# Altium project BEE-DAL_EXP_V1.0.PrjPcb (part 1 of 2)
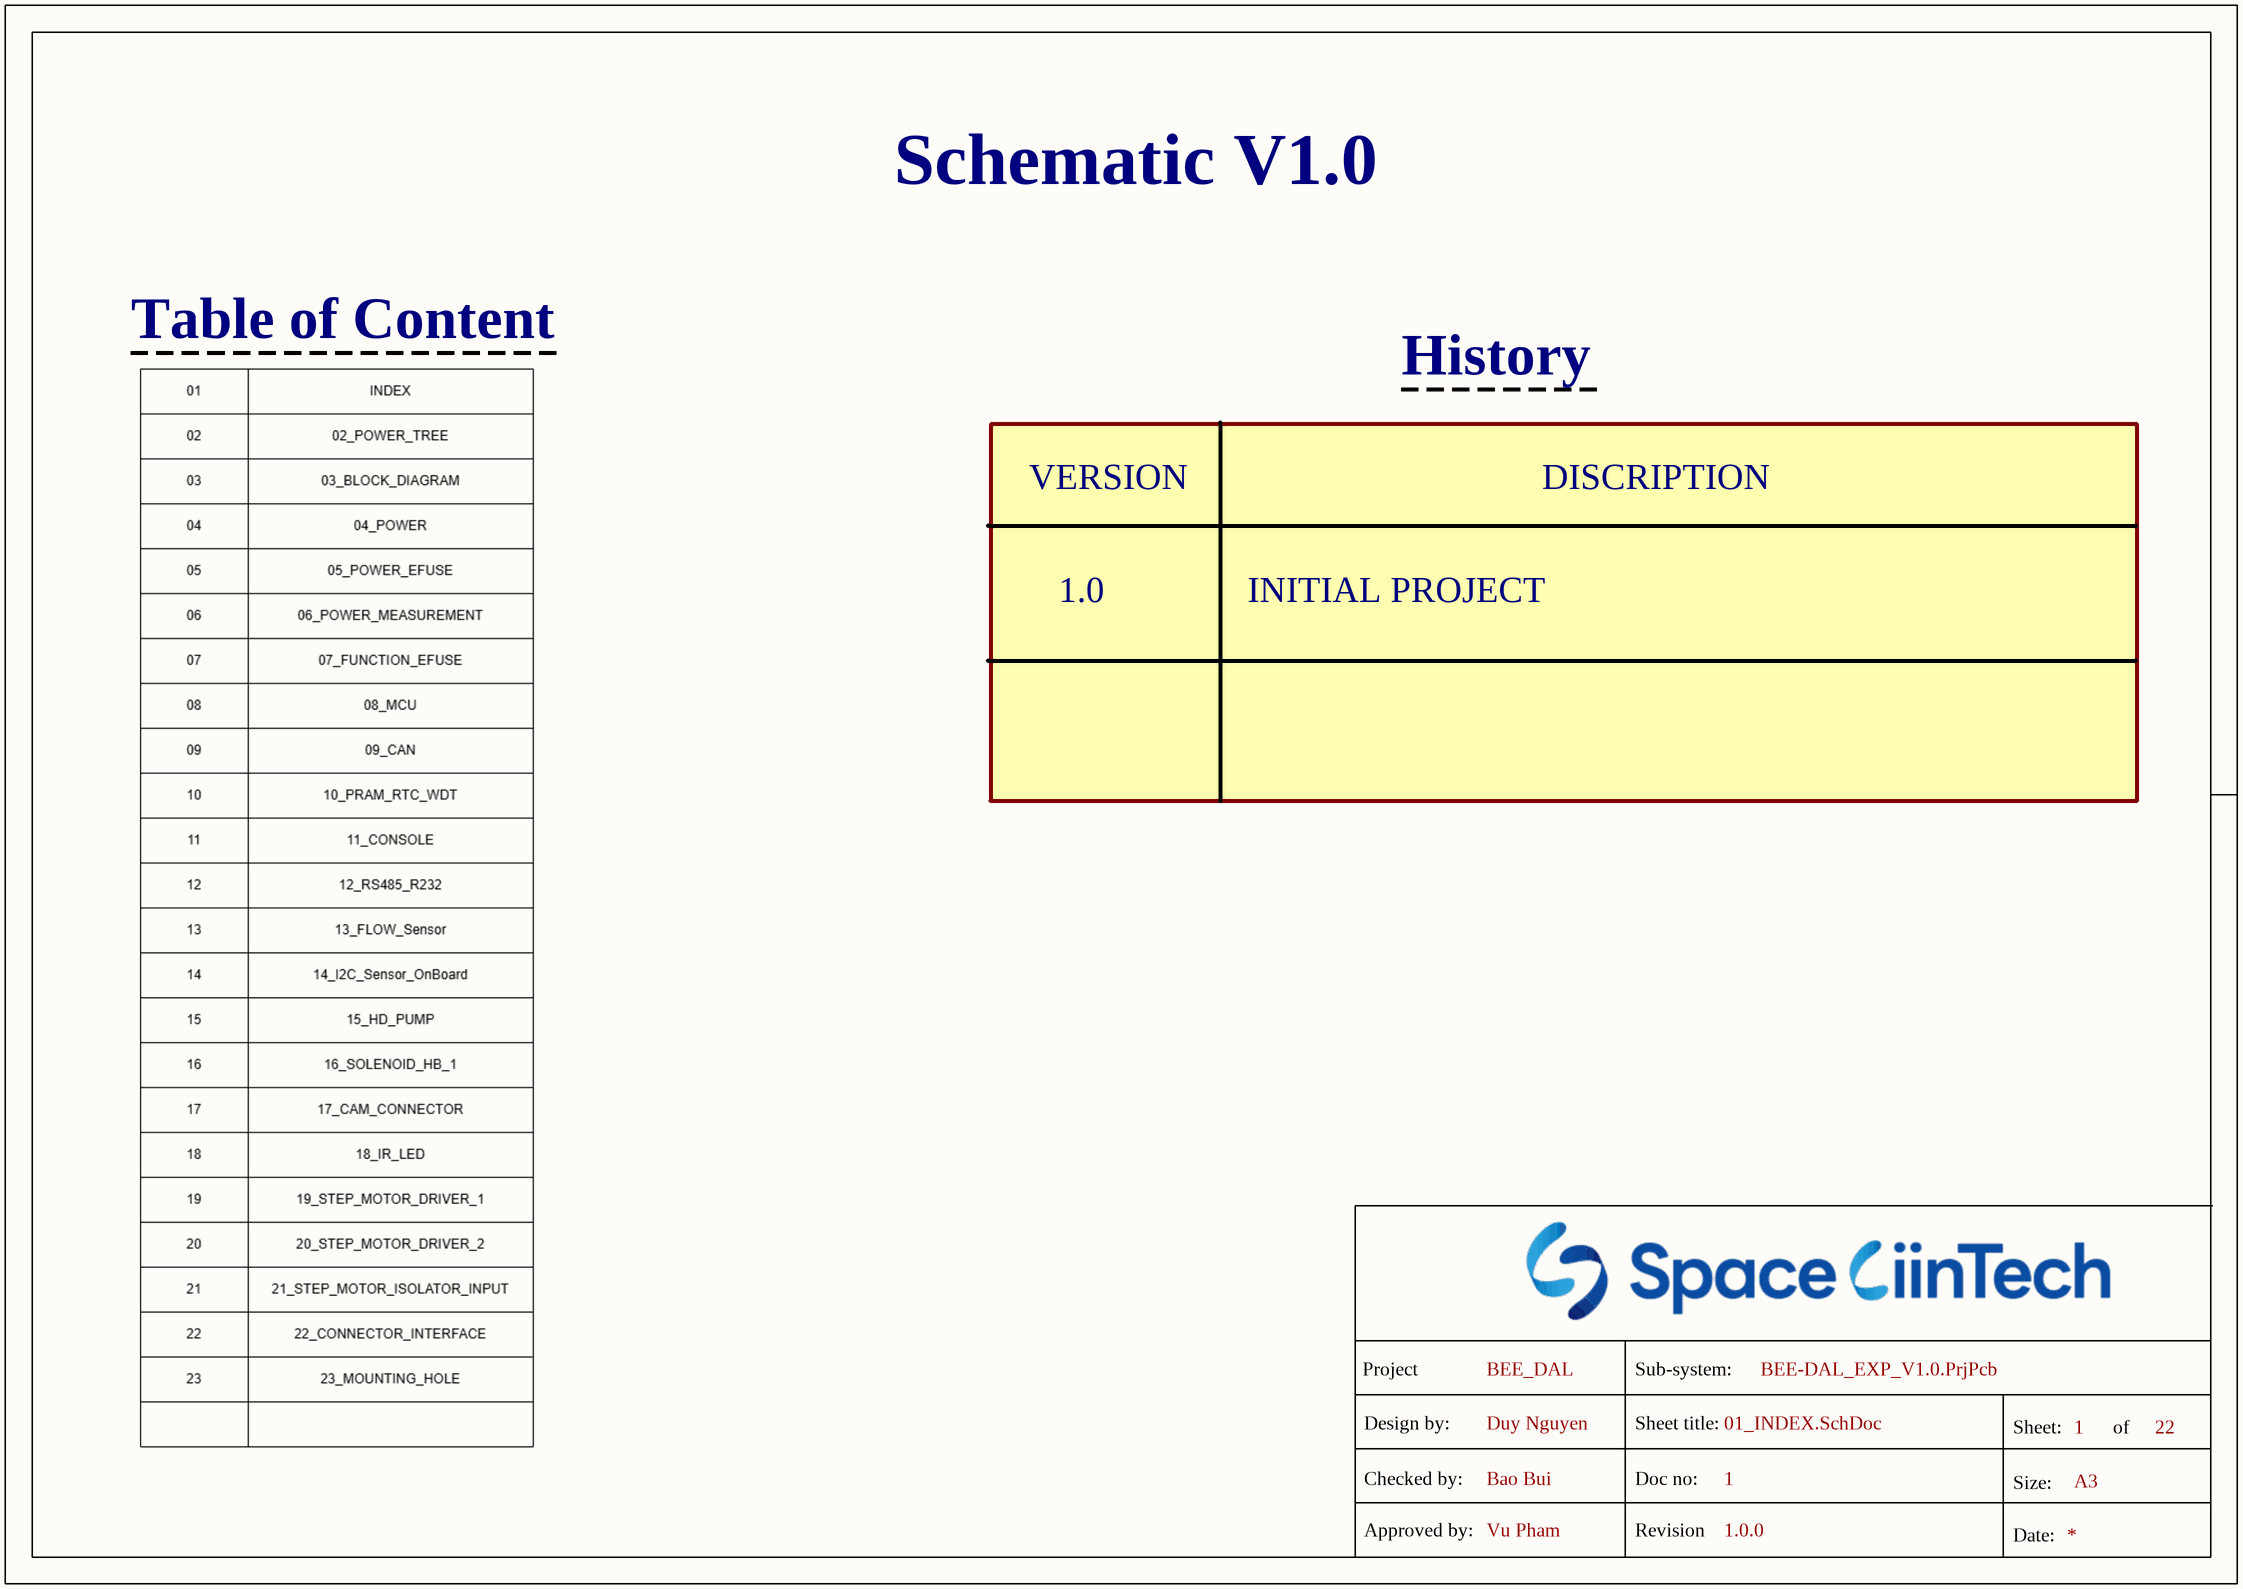
[diagram p0: 01_INDEX.SchDoc]
Approvedby: Vu Pham; Checkedby: Bao Bui; Drawnby: Duy Nguyen; MasterProject: BEE_DAL; Revision: 1.0.0; Size: A3
27 sheets, 708 parts. Net scope: flat (ports and power ports of the same name join across sheets).
Board file: BEE-DAL_EXP_V1.0.PcbDoc
Sheets:
  01_INDEX.SchDoc
  02_POWER_TREE.SchDoc
  03_BLOCK_DIAGRAM.SchDoc
  04_POWER.SchDoc
  05_POWER_EFUSE.SchDoc
  06_POWER_MEASUREMENT.SchDoc
  07_FUNCTION_EFUSE.SchDoc
  08_MCU.SchDoc
  09_CAN.SchDoc
  10_PRAM_RTC_WDT.SchDoc
  11_CONSOLE.SchDoc
  12_RS485_R232.SchDoc
  13_FLOW_Sensor.SchDoc
  14_I2C_Sensor_OnBoard.SchDoc
  15_HD_PUMP.SchDoc
  16_SOLENOID_HB_1.SchDoc
  17_CAM_CONNECTOR.SchDoc
  18_IR_LED.SchDoc
  HEATER.SchDoc
  NTC.SchDoc
  LIMIT_SENSORS.SchDoc
  HALF_BRIDGE_DRIVER.SchDoc
  19_STEP_MOTOR_DRIVER_1.SchDoc
  20_STEP_MOTOR_DRIVER_2.SchDoc
  21_STEP_MOTOR_ISOLATOR_INPUT.SchDoc
  22_CONNECTOR_INTERFACE.SchDoc
  23_MOUNTING_HOLE.SchDoc

## Sheet 01_INDEX.SchDoc
size 420 x 297 mm; SheetNumber: 1; SheetTotal: 22

### Notes on the sheet
- Schematic V1.0
- Table of Content
- History
- VERSION
- DISCRIPTION
- 1.0
- INITIAL PROJECT
- Project
- Sub-system:
- Design by:
- Sheet title:
- Sheet:
- of
- Checked by:
- Approved by:
- Doc no:
- Revision
- Size:
- Date:

## Sheet 02_POWER_TREE.SchDoc
size 420 x 297 mm; DrawnBy: Duy Nguyen; SheetNumber: 2; SheetTotal: 22

### Notes on the sheet
- Project
- Sub-system:
- Design by:
- Sheet title:
- Sheet:
- of
- Checked by:
- Approved by:
- Doc no:
- Revision
- Size:
- Date:
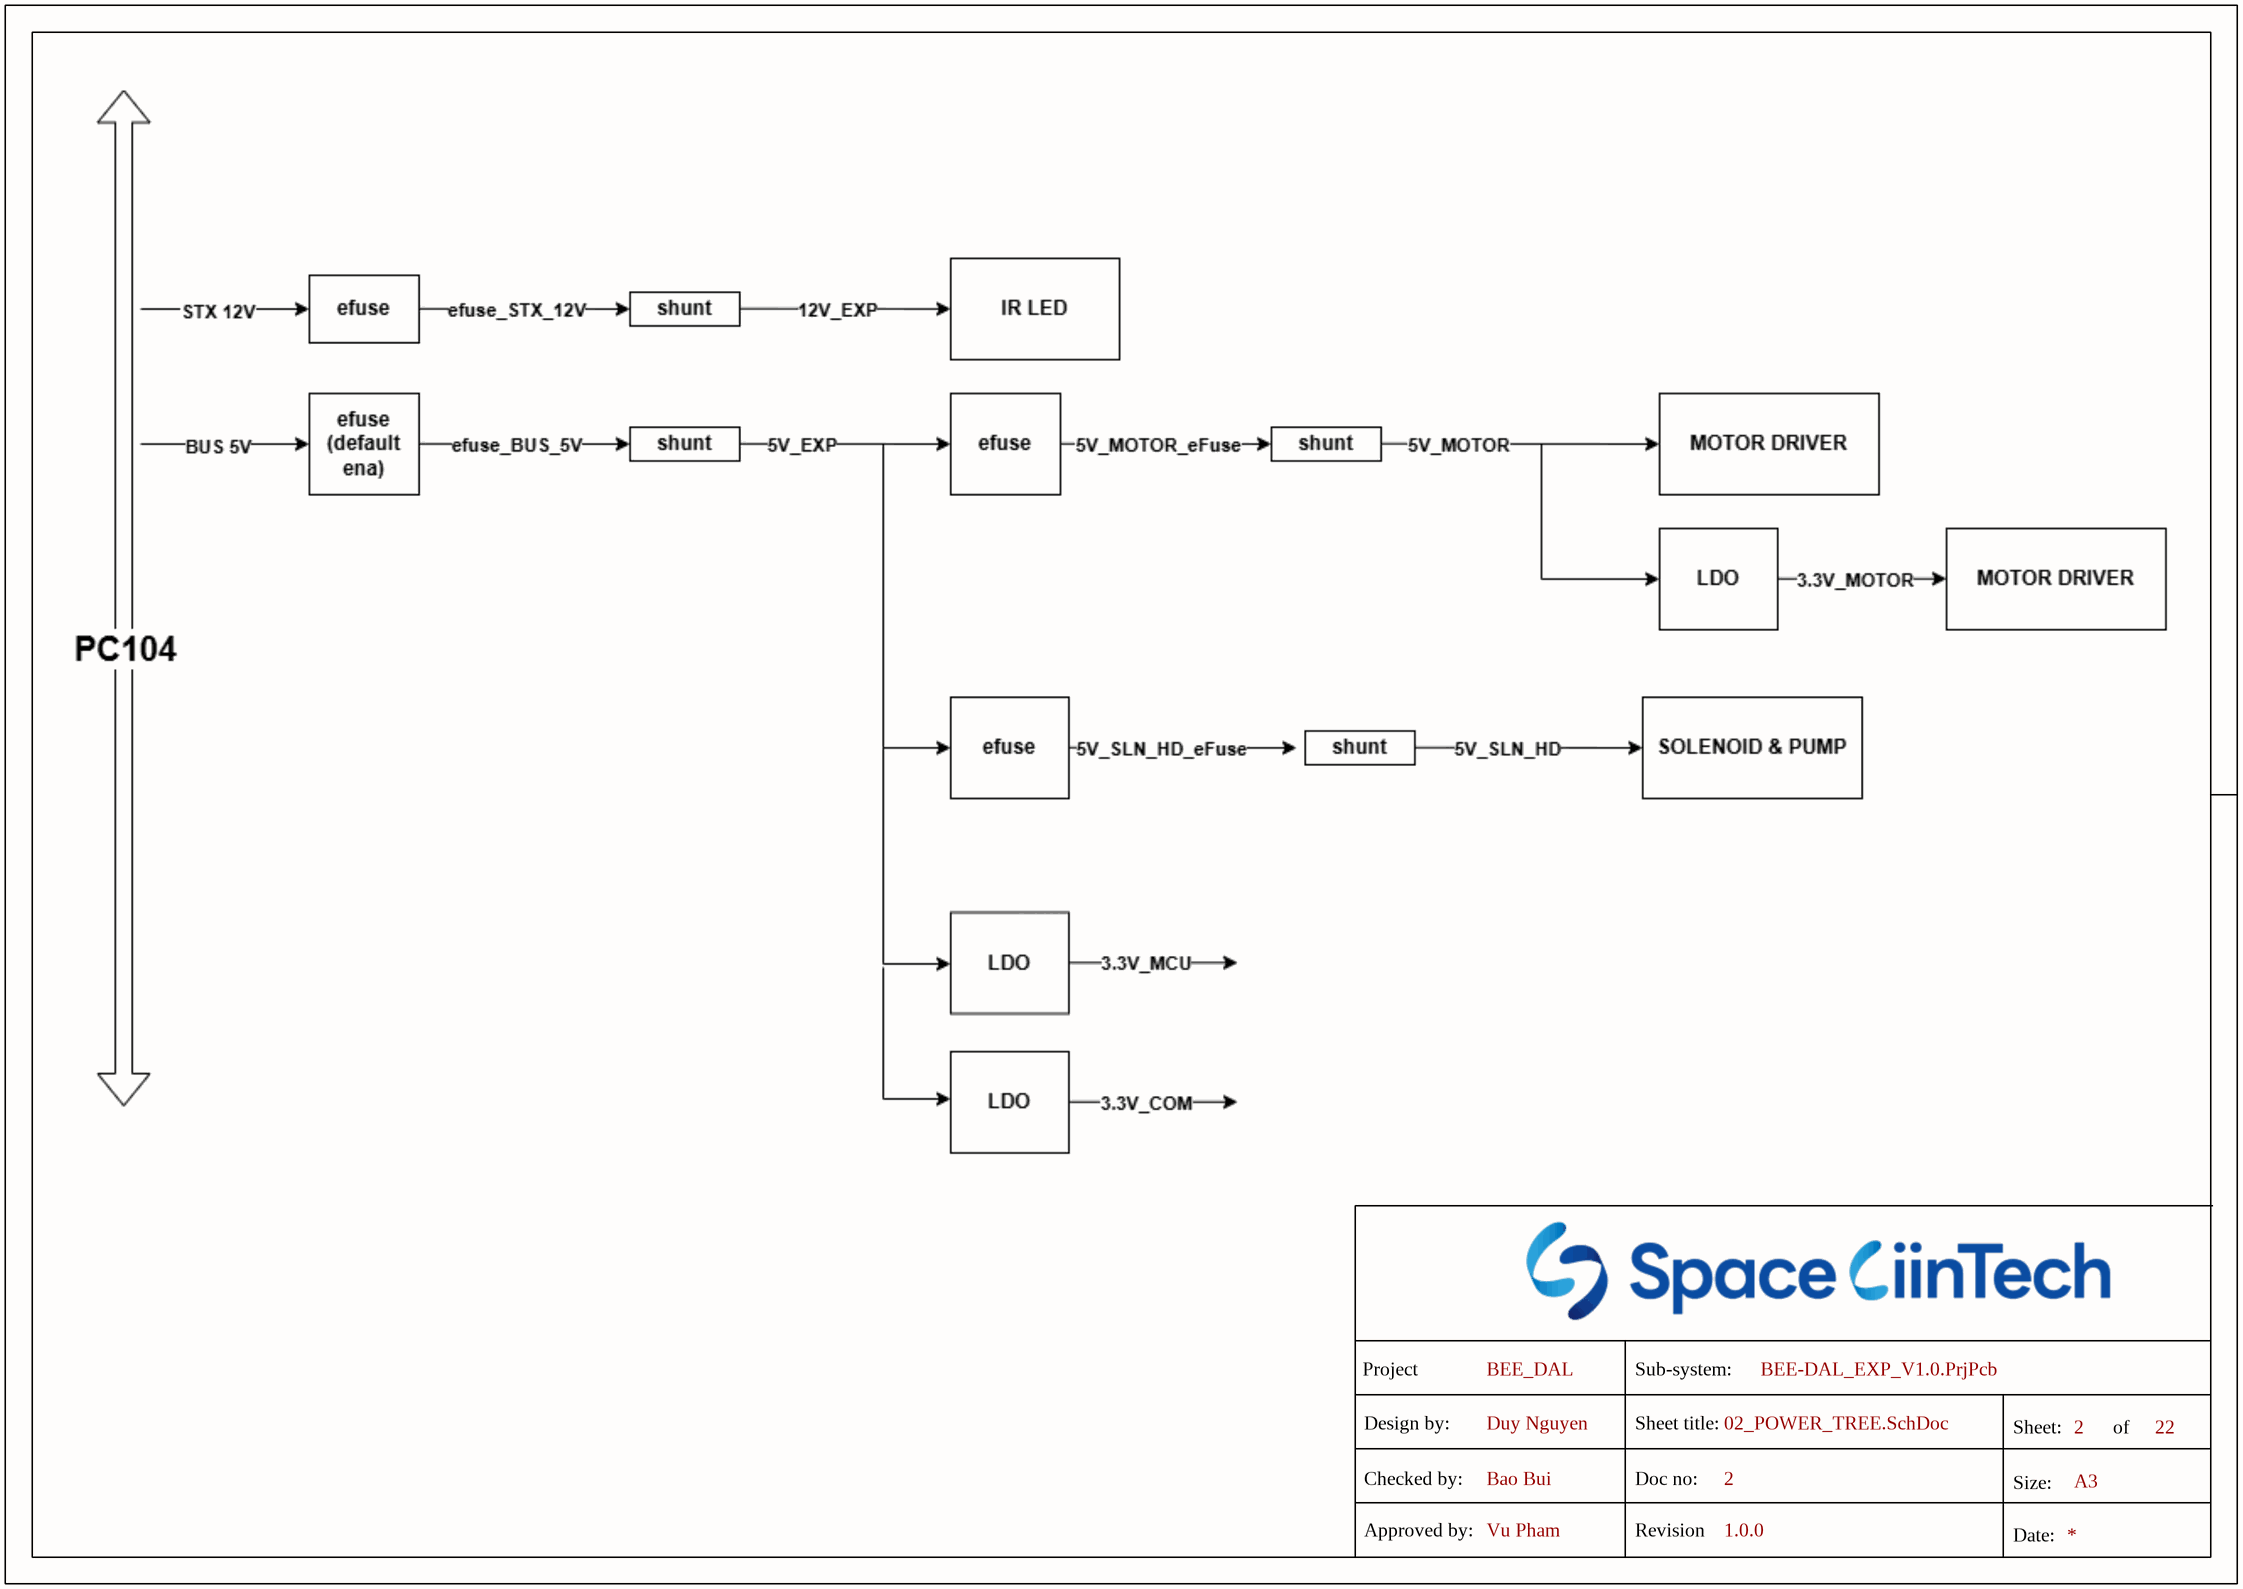
[diagram p1: 02_POWER_TREE.SchDoc]

## Sheet 03_BLOCK_DIAGRAM.SchDoc
size 420 x 297 mm; SheetNumber: 3; SheetTotal: 22

### Notes on the sheet
- Project
- Sub-system:
- Design by:
- Sheet title:
- Sheet:
- of
- Checked by:
- Approved by:
- Doc no:
- Revision
- Size:
- Date:
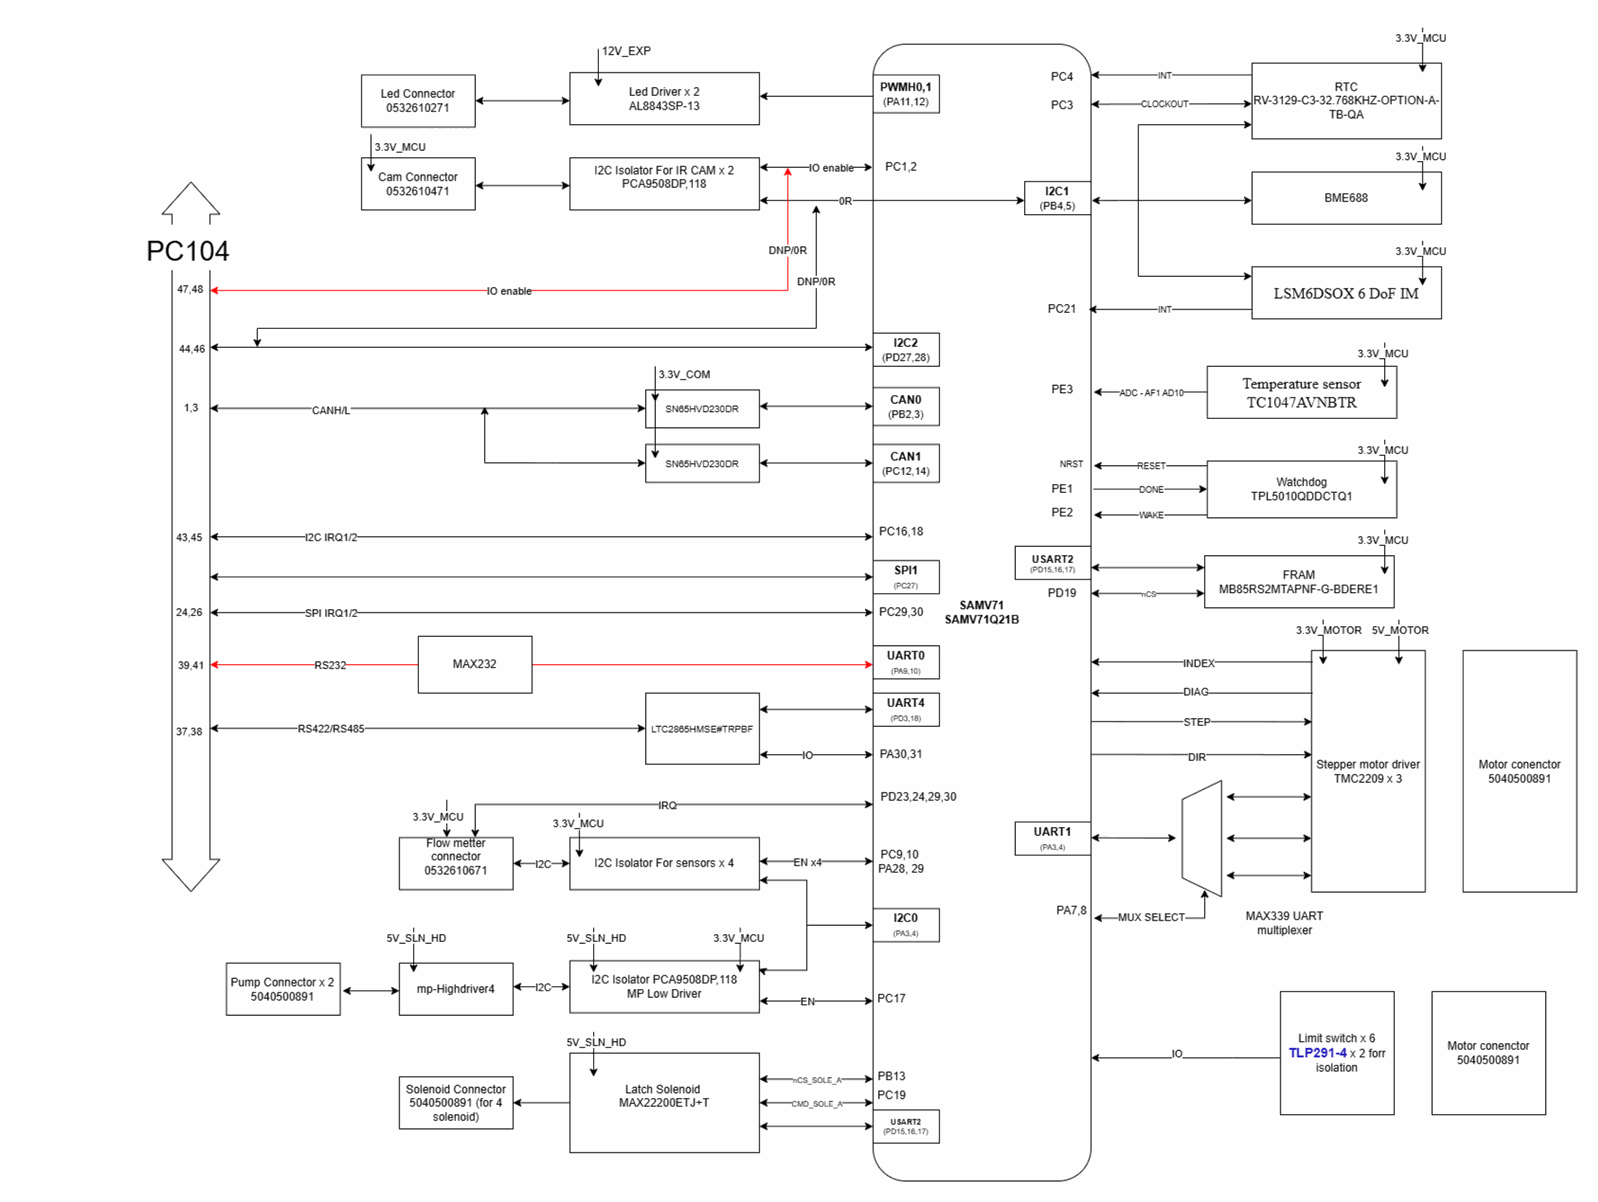
[diagram p2: 03_BLOCK_DIAGRAM.SchDoc]

## Sheet 04_POWER.SchDoc
size 420 x 297 mm; SheetNumber: 4; SheetTotal: 27
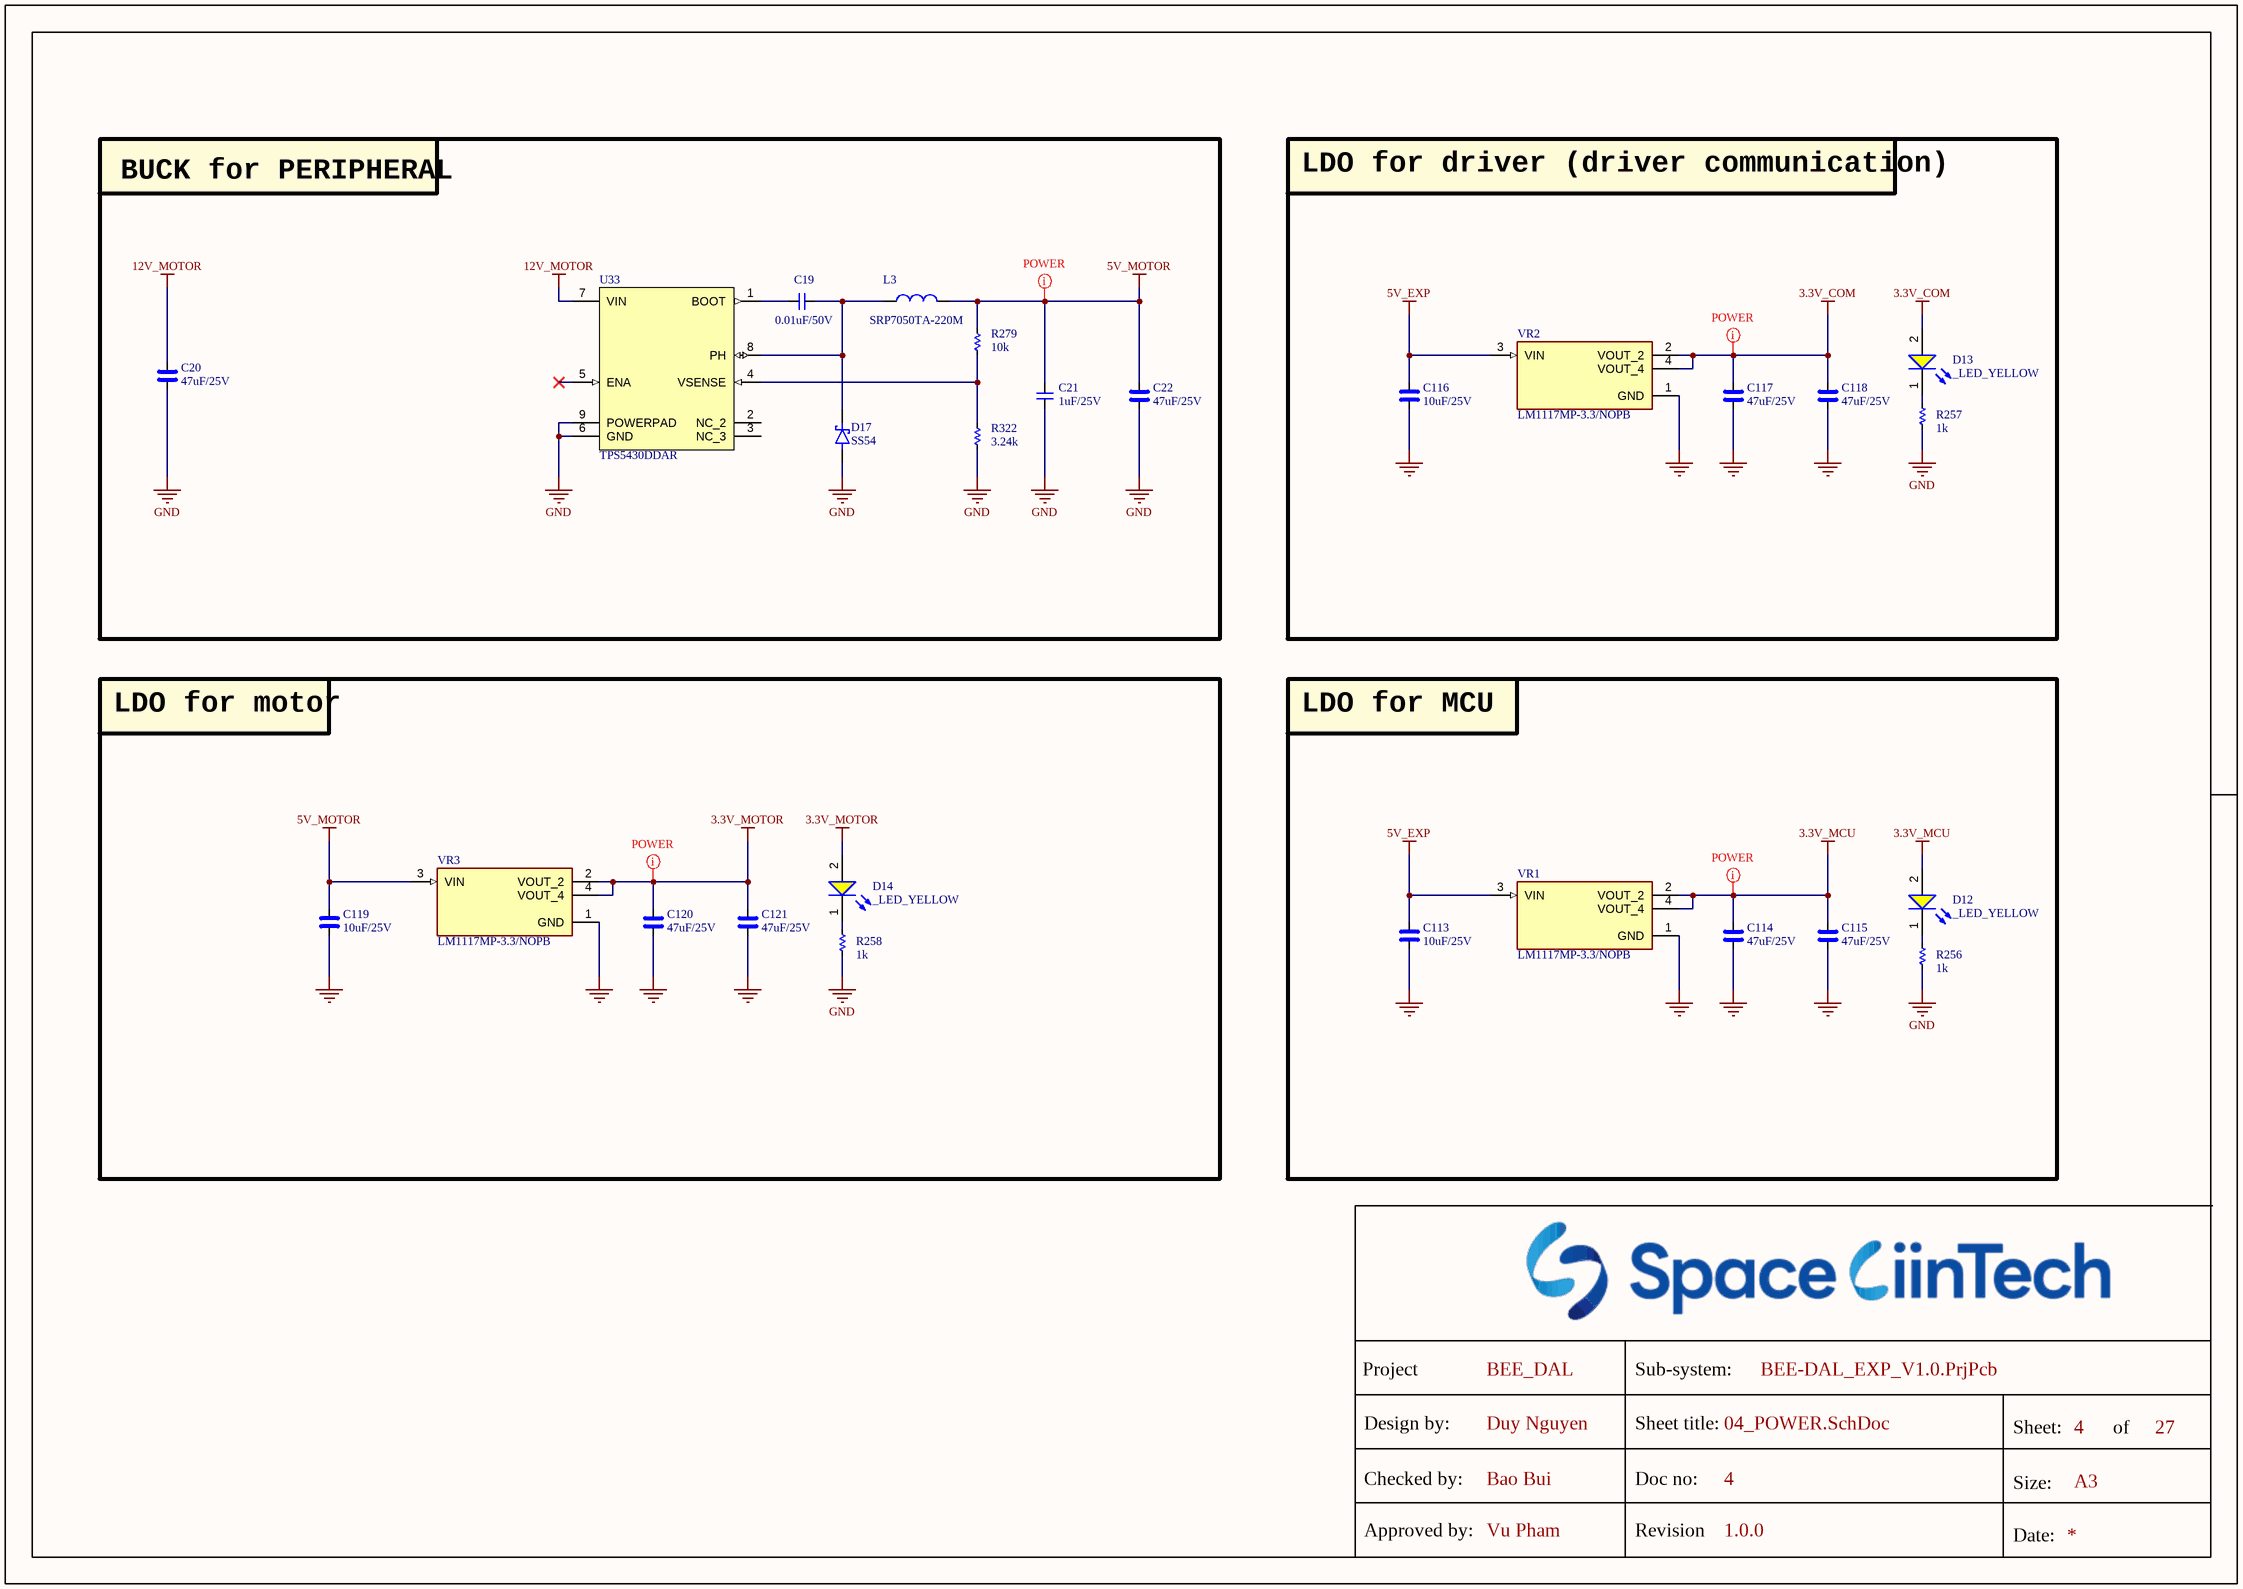
[diagram p3: 04_POWER.SchDoc]

### Parts
(Parts that share a designator on the sheet are numbered #1, #2 ... from top to bottom, then left to right.)
C19#1  0.01uF/50V  [CAP_C_1608X80]
C20#1  47uF/25V  [CAP_C_3225X80]
C21#1  1uF/25V  [CAP_C_1005X60]
C22#1  47uF/25V  [CAP_C_3225X80]
C113  10uF/25V  [CAP_C_2012X110]
C114  47uF/25V  [CAP_C_3225X80]
C115  47uF/25V  [CAP_C_3225X80]
C116  10uF/25V  [CAP_C_2012X110]
C117  47uF/25V  [CAP_C_3225X80]
C118  47uF/25V  [CAP_C_3225X80]
C119  10uF/25V  [CAP_C_2012X110]
C120  47uF/25V  [CAP_C_3225X80]
C121  47uF/25V  [CAP_C_3225X80]
D12  _LED_YELLOW  [LED_0603]
D13  _LED_YELLOW  [LED_0603]
D14  _LED_YELLOW  [LED_0603]
D17  SS54  [DO-214AC_SMA]
L3  SRP7050TA-220M  [PSM6050]
R256  1k  [RES_C_1005X40]
R257  1k  [RES_C_1005X40]
R258  1k  [RES_C_1005X40]
R279  10k  [RES_C_1005X40]
R322  3.24k  [RES_C_1005X40]
U33  TPS5430DDAR  [TPS54531DDAR]
VR1  LM1117MP-3.3/NOPB  [VREG_LM1117MP-3.3/NOPB]
VR2  LM1117MP-3.3/NOPB  [VREG_LM1117MP-3.3/NOPB]
VR3  LM1117MP-3.3/NOPB  [VREG_LM1117MP-3.3/NOPB]

### Blocks framed on the sheet
BUCK for PERIPHERAL: C19#1 C20#1 C21#1 C22#1 D17 L3 R279 R322 U33
LDO for driver (driver communication): C116-C118 D13 R257 VR2
LDO for motor: C119-C121 D14 R258 VR3
LDO for MCU: C113-C115 D12 R256 VR1

### Nets
3.3V_COM: C117.2 C118.2 D13.2(A) VR2.2(VOUT_2) VR2.4(VOUT_4)
3.3V_MCU: C114.2 C115.2 D12.2(A) VR1.2(VOUT_2) VR1.4(VOUT_4)
3.3V_MOTOR: C120.2 C121.2 D14.2(A) VR3.2(VOUT_2) VR3.4(VOUT_4)
5V_EXP: C113.1 C116.1 VR1.3(VIN) VR2.3(VIN)
5V_MOTOR: C21#1.2 C22#1.2 C119.1 L3.2 R279.2 VR3.3(VIN)
12V_MOTOR: C20#1.2 U33.7(VIN)
GND: C20#1.1 C21#1.1 C22#1.1 C113.2 C114.1 C115.1 C116.2 C117.1 C118.1 C119.2 C120.1 C121.1 D17.2(A) R256.1 R257.1 R258.1 R322.1 U33.6(GND) U33.9(POWERPAD) VR1.1(GND) VR2.1(GND) VR3.1(GND)
NetC19#1_1: C19#1.1 D17.1(K) L3.1 U33.8(PH)
NetC19#1_2: C19#1.2 U33.1(BOOT)
NetD12_1: D12.1(K) R256.2
NetD13_1: D13.1(K) R257.2
NetD14_1: D14.1(K) R258.2
NetR279_1: R279.1 R322.2 U33.4(VSENSE)

Not connected (* = marked no-connect by the designer): U33 2(NC_2) 3(NC_3) 5(ENA)*

### Layout directives
net class POWER: 3.3V_COM, 3.3V_MCU, 3.3V_MOTOR, 5V_MOTOR

### Notes on the sheet
- Project
- Sub-system:
- Design by:
- Sheet title:
- Sheet:
- of
- Checked by:
- Approved by:
- Doc no:
- Revision
- Size:
- Date:

### Library data of the parts
C19#1 C21#1 = _CAP_C_2: CAP
C20#1 C22#1 C113-C121 = _CAP_C_High_2: CAP High Value
D17 = DIODE SCHOTTKY
L3 = SRP7050TA-220M: FIXED IND 22UH 2.5A 170 MOHM SMD
R256-R258 R279 R322 = _RES_B_2: RES
U33 = TPS5430DDAR: IC REG BUCK ADJ 3A 8SOPWR
VR1-VR3 = LM1117MP-3.3/NOPB: 800-mA 15-V linear voltage regulator; MF: Texas Instruments; SnapEDA_Link: https://www.snapeda.com/parts/LM1117MP-3.3/NOPB/Texas+Instruments/view-part/?ref=snap; Package: SOT-223-4 Texas Instruments; Value: *; MP: LM1117MP-3.3/NOPB; Check_prices: https://www.snapeda.com/parts/LM1117MP-3.3/NOPB/Texas+Instruments/view-part/?ref=eda

## Sheet 05_POWER_EFUSE.SchDoc
size 420 x 297 mm; SheetNumber: 5; SheetTotal: 27
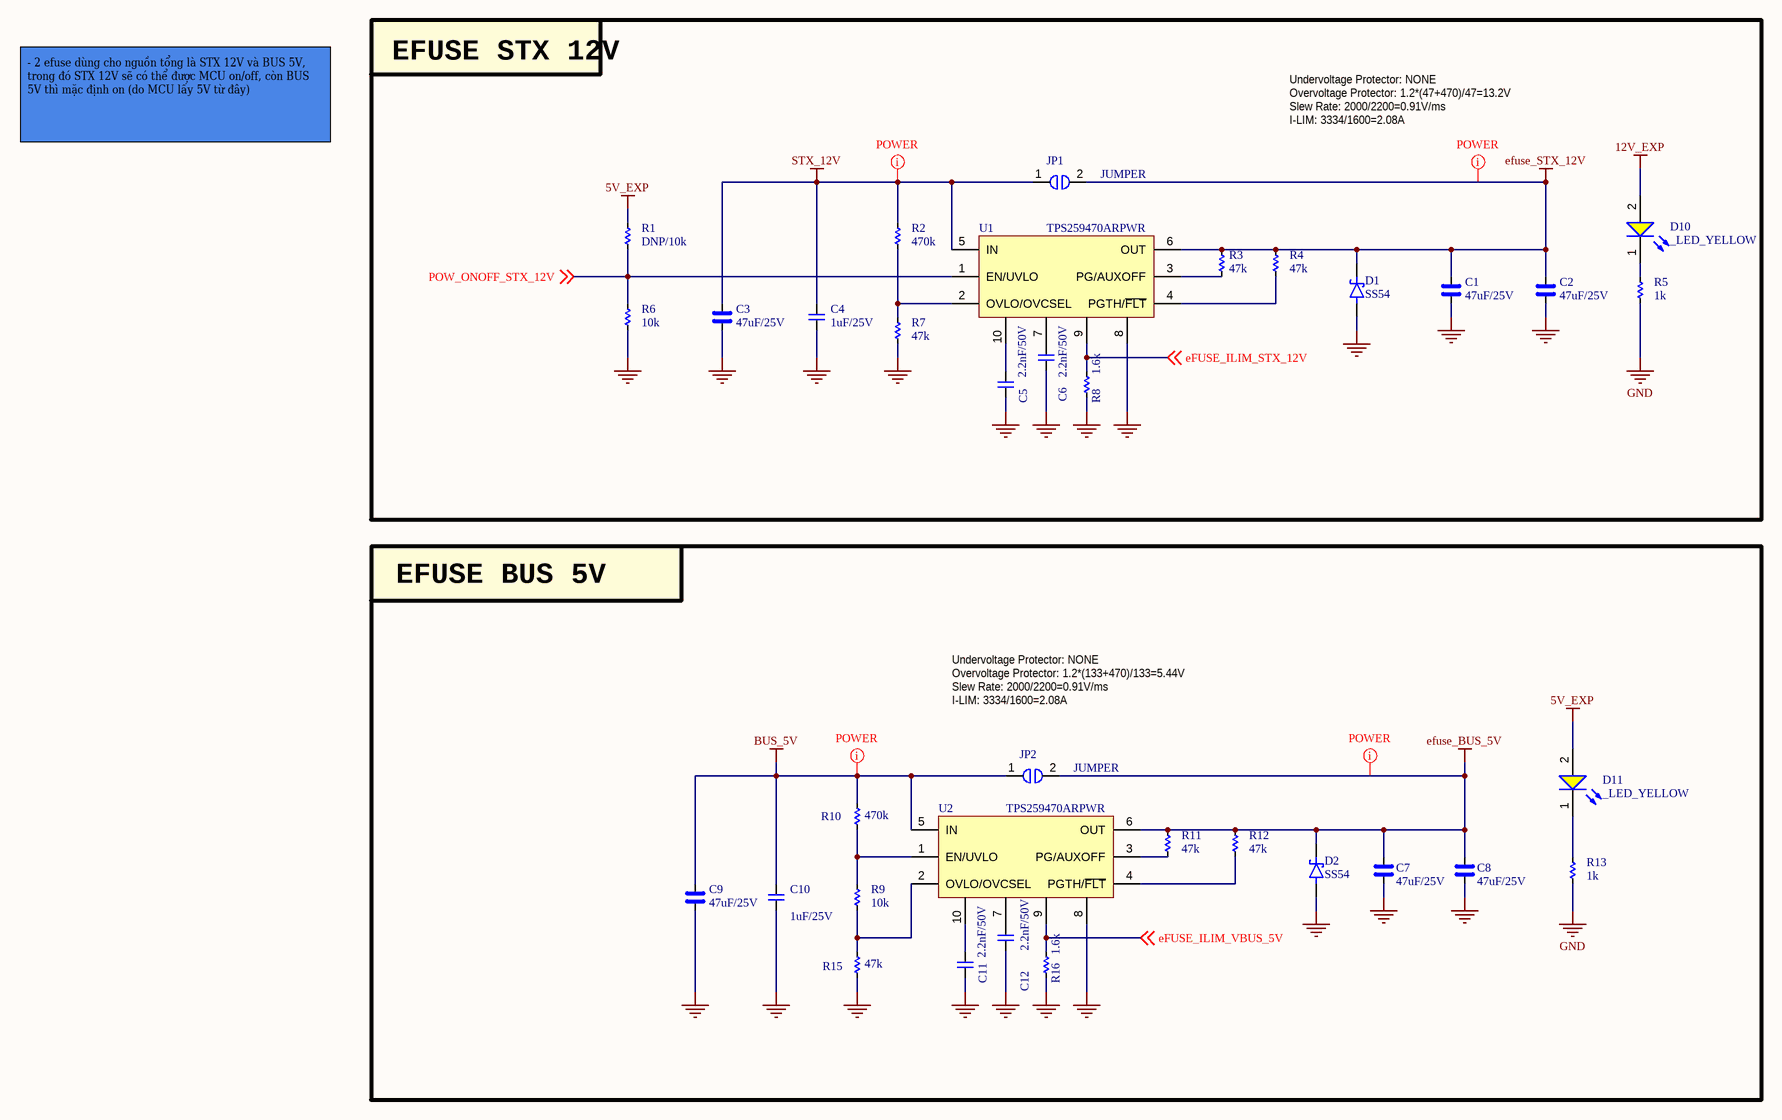
[diagram p4: 05_POWER_EFUSE.SchDoc]

### Parts
C1  47uF/25V  [CAP_C_3225X80]
C2  47uF/25V  [CAP_C_3225X80]
C3  47uF/25V  [CAP_C_3225X80]
C4  1uF/25V  [CAP_C_1005X60]
C5  2.2nF/50V  [CAP_C_1005X60]
C6  2.2nF/50V  [CAP_C_1005X60]
C7  47uF/25V  [CAP_C_3225X80]
C8  47uF/25V  [CAP_C_3225X80]
C9  47uF/25V  [CAP_C_3225X80]
C10  1uF/25V  [CAP_C_1005X60]
C11  2.2nF/50V  [CAP_C_1005X60]
C12  2.2nF/50V  [CAP_C_1005X60]
D1  SS54  [DO-214AC_SMA]
D2  SS54  [DO-214AC_SMA]
D10  _LED_YELLOW  [LED_0603]
D11  _LED_YELLOW  [LED_0603]
JP1  JUMPER  [JUMPER_1608]
JP2  JUMPER  [JUMPER_1608]
R1  DNP/10k  [RES_C_1005X40]
R2  470k  [RES_C_1005X40]
R3  47k  [RES_C_1005X40]
R4  47k  [RES_C_1005X40]
R5  1k  [RES_C_1005X40]
R6  10k  [RES_C_1005X40]
R7  47k  [RES_C_1005X40]
R8  1.6k  [RES_C_1005X40]
R9  10k  [RES_C_1005X40]
R10  470k  [RES_C_1005X40]
R11  47k  [RES_C_1005X40]
R12  47k  [RES_C_1005X40]
R13  1k  [RES_C_1005X40]
R15  47k  [RES_C_1005X40]
R16  1.6k  [RES_C_1005X40]
U1  TPS259470ARPWR  [VQFN-HR-10]
U2  TPS259470ARPWR  [VQFN-HR-10]

### Blocks framed on the sheet
EFUSE STX 12V: C1-C6 D1 D10 JP1 R1-R8 U1
EFUSE BUS 5V: C7-C12 D2 D11 JP2 R9-R13 R15 R16 U2

### Nets
5V_EXP: D11.2(A) R1.1
12V_EXP: D10.2(A)
BUS_5V: C9.2 C10.2 JP2.1 R10.2 U2.5(IN)
efuse_BUS_5V: C7.2 C8.2 D2.1(K) JP2.2 R11.2 R12.2 U2.6(OUT)
efuse_STX_12V: C1.2 C2.2 D1.1(K) JP1.2 R3.2 R4.2 U1.6(OUT)
GND: C1.1 C2.1 C3.1 C4.1 C5.1 C6.1 C7.1 C8.1 C9.1 C10.1 C11.1 C12.1 D1.2(A) D2.2(A) R5.1 R6.2 R7.1 R8.1 R13.1 R15.1 R16.1 U1.8 U2.8
STX_12V: C3.2 C4.2 JP1.1 R2.2 U1.5(IN)
eFUSE_ILIM_STX_12V: R8.2 U1.9 ; off-sheet eFUSE_ILIM_STX_12V
eFUSE_ILIM_VBUS_5V: R16.2 U2.9 ; off-sheet eFUSE_ILIM_VBUS_5V
POW_ONOFF_STX_12V: R1.2 R6.1 U1.1(EN/UVLO) ; off-sheet POW_ONOFF_STX_12V
NetC5_2: C5.2 U1.10
NetC6_2: C6.2 U1.7
NetC11_2: C11.2 U2.10
NetC12_2: C12.2 U2.7
NetD10_1: D10.1(K) R5.2
NetD11_1: D11.1(K) R13.2
NetR2_1: R2.1 R7.2 U1.2(OVLO/OVCSEL)
NetR3_1: R3.1 U1.3(PG/AUXOFF)
NetR4_1: R4.1 U1.4(PGTH/~{FLT})
NetR9_1: R9.1 R15.2 U2.2(OVLO/OVCSEL)
NetR9_2: R9.2 R10.1 U2.1(EN/UVLO)
NetR11_1: R11.1 U2.3(PG/AUXOFF)
NetR12_1: R12.1 U2.4(PGTH/~{FLT})

### Layout directives
net class POWER: BUS_5V, efuse_BUS_5V, efuse_STX_12V, STX_12V

### Notes on the sheet
- - 2 efuse dùng cho nguồn tổng là STX 12V và BUS 5V, trong đó STX 12V sẽ có thể được MCU on/off, còn BUS 5V thì mặc định on (do MCU lấy 5V từ đây)
- Undervoltage Protector: NONE
- Overvoltage Protector: 1.2*(47+470)/47=13.2V
- Slew Rate: 2000/2200=0.91V/ms
- I-LIM: 3334/1600=2.08A
- Overvoltage Protector: 1.2*(133+470)/133=5.44V
- Project
- Sub-system:
- Design by:
- Sheet title:
- Sheet:
- of
- Checked by:
- Approved by:
- Doc no:
- Revision
- Size:
- Date:

### Library data of the parts
C1-C3 C7-C9 = _CAP_C_High_2: CAP High Value
C4-C6 C10-C12 = _CAP_C_2: CAP
D1 D2 = DIODE SCHOTTKY
JP1 JP2 = JUMPER_1_1
R1-R13 R15 R16 = _RES_B_2: RES

## Sheet 06_POWER_MEASUREMENT.SchDoc
size 420 x 297 mm; SheetNumber: 6; SheetTotal: 27
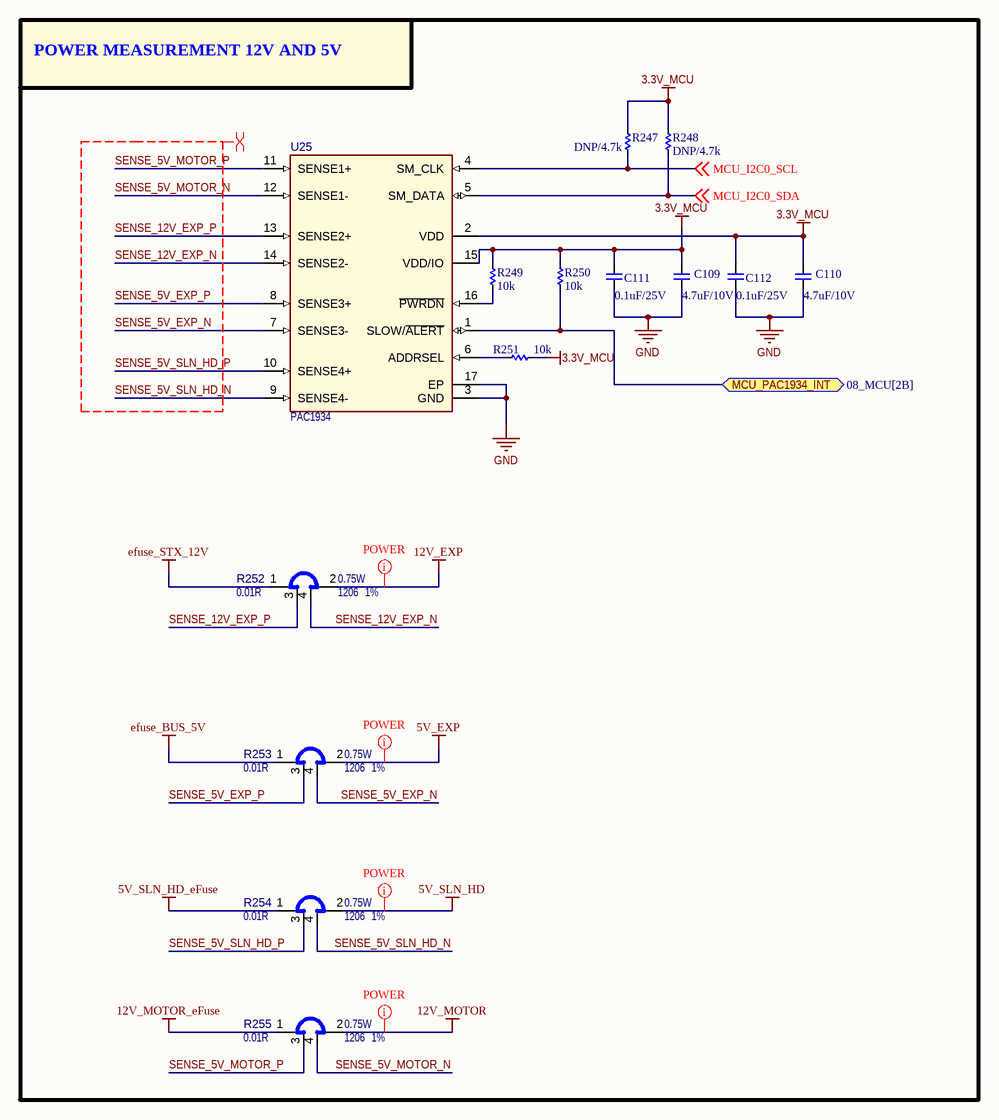
[diagram p5: 06_POWER_MEASUREMENT.SchDoc]

### Parts
C109  4.7uF/10V  [CAP_C_1005X60]
C110  4.7uF/10V  [CAP_C_1005X60]
C111  0.1uF/25V  [CAP_C_1005X60]
C112  0.1uF/25V  [CAP_C_1005X60]
R247  DNP/4.7k  [RES_C_1005X40]
R248  DNP/4.7k  [RES_C_1005X40]
R249  10k  [RES_C_1005X40]
R250  10k  [RES_C_1005X40]
R251  10k  [RES_C_1005X40]
R252  value 0.01R  Package: 1206  Tolerance: 1%  Power: 0.75W  [RES_C_1206_SHUNT]  (hidden comment: KRL1632E-M-R010-F-T5)
R253  value 0.01R  Package: 1206  Tolerance: 1%  Power: 0.75W  [RES_C_1206_SHUNT]  (hidden comment: KRL1632E-M-R010-F-T5)
R254  value 0.01R  Package: 1206  Tolerance: 1%  Power: 0.75W  [RES_C_1206_SHUNT]  (hidden comment: KRL1632E-M-R010-F-T5)
R255  value 0.01R  Package: 1206  Tolerance: 1%  Power: 0.75W  [RES_C_1206_SHUNT]  (hidden comment: KRL1632E-M-R010-F-T5)
U25  value PAC1934  [UQFN-16_4X4_EP2.6X2.6]  (hidden comment: PAC1934 UQFN-16)

### Blocks framed on the sheet
POWER MEASUREMENT 12V AND 5V: C109-C112 R247-R255 U25

### Ports
MCU_PAC1934_INT (bidir, see 08_MCU[2B])

### Nets
3.3V_MCU: C109.1 C110.1 C111.1 C112.1 R247.1 R248.1 R249.1 R250.1 R251.2 U25.2(VDD) U25.15(VDD/IO)
5V_EXP: R253.2
5V_SLN_HD: R254.2
5V_SLN_HD_eFuse: R254.1
12V_EXP: R252.2
12V_MOTOR: R255.2
12V_MOTOR_eFuse: R255.1
efuse_BUS_5V: R253.1
efuse_STX_12V: R252.1
GND: C109.2 C110.2 C111.2 C112.2 U25.3(GND) U25.17(EP)
MCU_I2C0_SCL: R247.2 U25.4(SM_CLK) ; off-sheet MCU_I2C0_SCL
MCU_I2C0_SDA: R248.2 U25.5(SM_DATA) ; off-sheet MCU_I2C0_SDA
SENSE_5V_EXP_N: R253.4 U25.7(SENSE3-)
SENSE_5V_EXP_P: R253.3 U25.8(SENSE3+)
SENSE_5V_MOTOR_N: R255.4 U25.12(SENSE1-)
SENSE_5V_MOTOR_P: R255.3 U25.11(SENSE1+)
SENSE_5V_SLN_HD_N: R254.4 U25.9(SENSE4-)
SENSE_5V_SLN_HD_P: R254.3 U25.10(SENSE4+)
SENSE_12V_EXP_N: R252.4 U25.14(SENSE2-)
SENSE_12V_EXP_P: R252.3 U25.13(SENSE2+)
NetR61_2: R250.2 U25.1(SLOW/~{ALERT}) ; port MCU_PAC1934_INT
NetR249_2: R249.2 U25.16(~{PWRDN})
NetR251_1: R251.1 U25.6(ADDRSEL)

### Layout directives
differential pair: SENSE_5V_EXP_N, SENSE_5V_EXP_P, SENSE_5V_MOTOR_N, SENSE_5V_MOTOR_P, SENSE_5V_SLN_HD_N, SENSE_5V_SLN_HD_P, SENSE_12V_EXP_N, SENSE_12V_EXP_P
net class POWER: 5V_EXP, 5V_SLN_HD, 12V_EXP, 12V_MOTOR

### Notes on the sheet
- Project
- Sub-system:
- Design by:
- Sheet title:
- Sheet:
- of
- Checked by:
- Approved by:
- Doc no:
- Revision
- Size:
- Date:

### Library data of the parts
C109-C112 = _CAP_C_2: CAP
R247-R251 = _RES_B_2: RES
R252-R255 = RSMT1316: Shunt; Manufacturer 1: SUSUMU; Description_: RES SHUNT MF 0.01R 1% 0.75W SMD 1206; Dev Tools Status: Design; Temperature Coeffcient: 50ppm/C; Current: 8A; Owner: Ciprian Abramov; Populated: YES; MCHP-ID: RSMT1316; Revision: 1; Symbol: Shunt 4 Pin; Status: MCL Design; ComponentLink1URL: https://chn-vm-apps.microchip.com/mchprepo/parts/Datasheets/n_catalog_partition09_en.pdf; ComponentLink1Description: SVN Datasheet; ComponentLink2URL: C:\ALTIUM_WORK\00001_MCHP-CDB\Datasheets\n_catalog_partition09_en.pdf; ComponentLink2Description: Local Datasheet; ComponentLink3URL: C:\ALTIUM_WORK\00001_MCHP-CDB\Library\LibraryRefs\Shunt 4 Pin.SchLib; ComponentLink3Description: Open Symbol; ComponentLink4URL: C:\ALTIUM_WORK\00001_MCHP-CDB\Library\Footprints\RES_C_1206_SHUNT.PcbLib; ComponentLink4Description: Open Footprint; ComponentLink5Description: Open Footprint 2; ComponentLink6Description: Open Footprint 3; ComponentLink7Description: Open Footprint 4; Operating Temperature: -55C to +155C; Category: Resistor; Type: RES SMD; Composition: MF; Manufacturer Part Number 1: KRL1632E-M-R010-F-T5; Supplier 1: Digi-Key; Supplier Part Number 1: 408-1570-1-ND; Quantity Override: 1
U25 = MIC8883: Manufacturer 1: Microchip Technology; Manufacturer Part Number 1: PAC1934T-I/JQ; Description_: MCHP ANALOG POWER CURRENT SENSE MONITOR PAC1934T-I/JQ UQFN-16; Dev Tools Status: Design; Owner: Ciprian Abramov; Populated: YES; MCHP-ID: MIC8883; Symbol: PAC1934 UQFN-16; Type: Power/Current Sensor; Status: MCL Design; Revision: 1; Category: MCHP-Analog; ComponentLink1Description: SVN Datasheet; ComponentLink2Description: Local Datasheet; ComponentLink3URL: C:\ALTIUM_WORK\00001_MCHP-CDB\Library\LibraryRefs\PAC1934 UQFN-16.SchLib; ComponentLink3Description: Open Symbol; ComponentLink4URL: C:\ALTIUM_WORK\00001_MCHP-CDB\Library\Footprints\UQFN-16_4X4_EP2.6X2.6.PcbLib; ComponentLink4Description: Open Footprint; ComponentLink5Description: Open Footprint 2; ComponentLink6Description: Open Footprint 3; ComponentLink7Description: Open Footprint 4; Supplier 1: Digi-Key; Supplier Part Number 1: PAC1934T-I/JQCT-ND; Quantity Override: 1

## Sheet 07_FUNCTION_EFUSE.SchDoc
size 420 x 297 mm; SheetNumber: 7; SheetTotal: 27
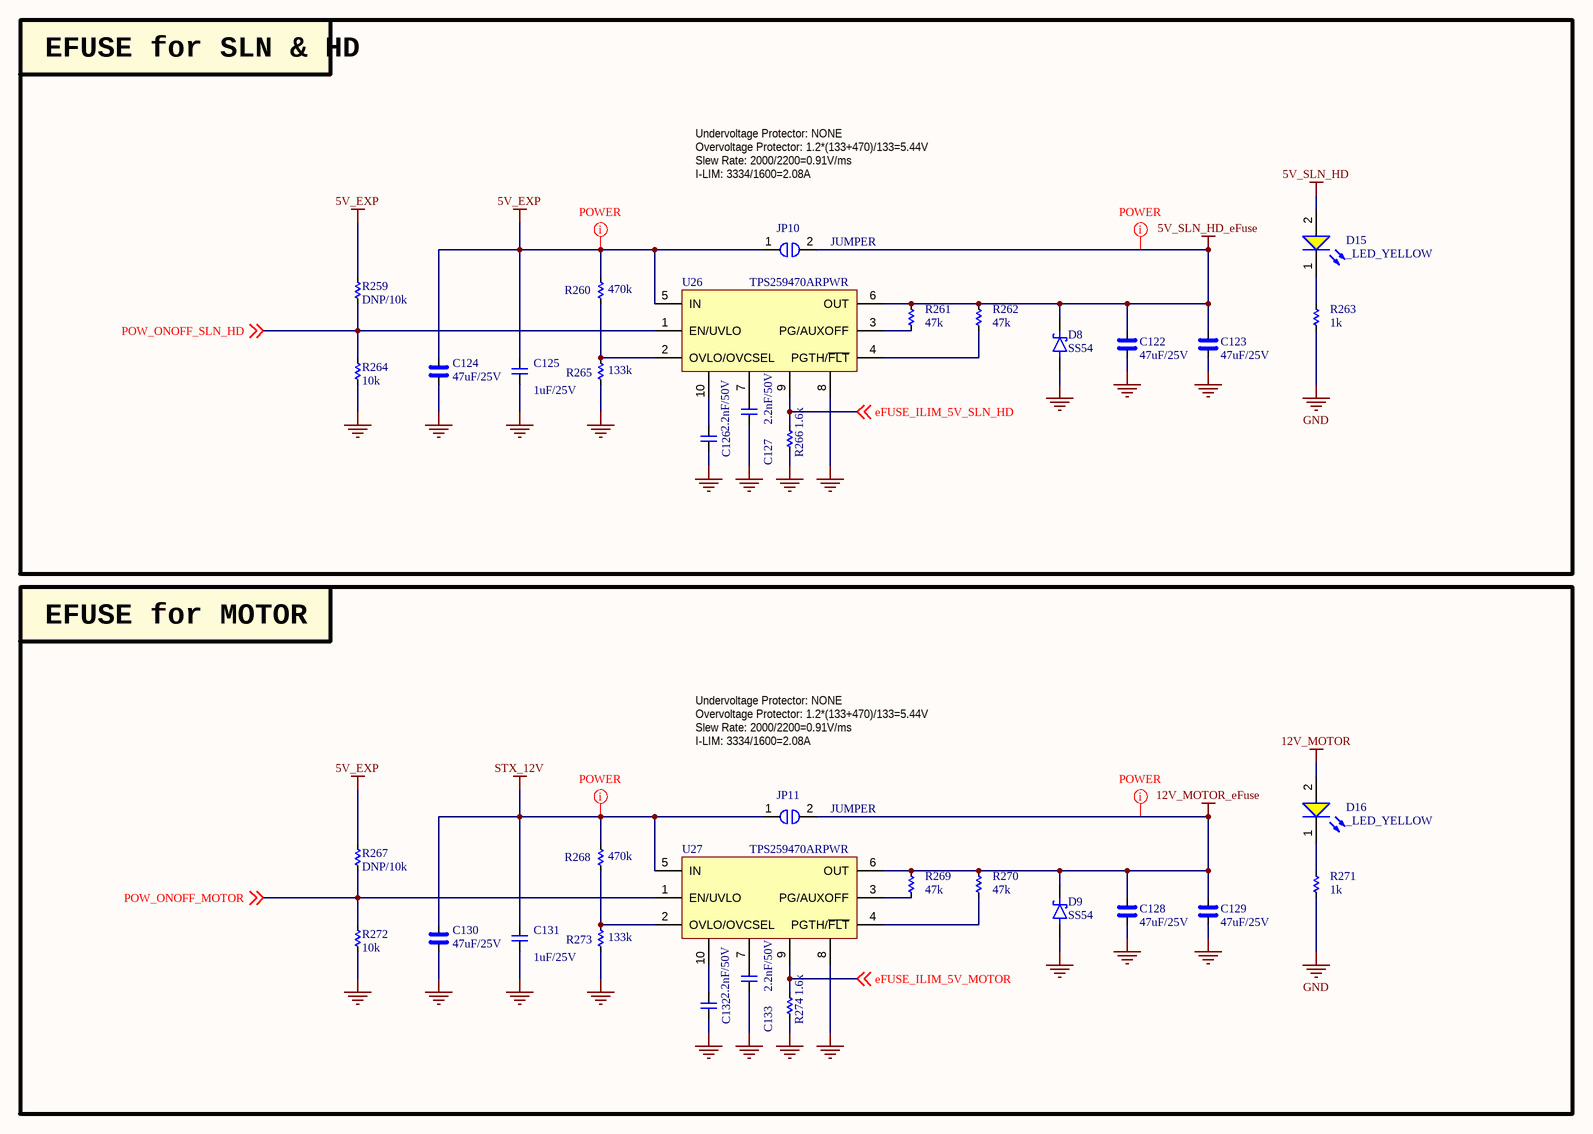
[diagram p6: 07_FUNCTION_EFUSE.SchDoc]

### Parts
C122  47uF/25V  [CAP_C_3225X80]
C123  47uF/25V  [CAP_C_3225X80]
C124  47uF/25V  [CAP_C_3225X80]
C125  1uF/25V  [CAP_C_1005X60]
C126  2.2nF/50V  [CAP_C_1005X60]
C127  2.2nF/50V  [CAP_C_1005X60]
C128  47uF/25V  [CAP_C_3225X80]
C129  47uF/25V  [CAP_C_3225X80]
C130  47uF/25V  [CAP_C_3225X80]
C131  1uF/25V  [CAP_C_1005X60]
C132  2.2nF/50V  [CAP_C_1005X60]
C133  2.2nF/50V  [CAP_C_1005X60]
D8  SS54  [DO-214AC_SMA]
D9  SS54  [DO-214AC_SMA]
D15  _LED_YELLOW  [LED_0603]
D16  _LED_YELLOW  [LED_0603]
JP10  JUMPER  [JUMPER_1608]
JP11  JUMPER  [JUMPER_1608]
R259  DNP/10k  [RES_C_1005X40]
R260  470k  [RES_C_1005X40]
R261  47k  [RES_C_1005X40]
R262  47k  [RES_C_1005X40]
R263  1k  [RES_C_1005X40]
R264  10k  [RES_C_1005X40]
R265  133k  [RES_C_1005X40]
R266  1.6k  [RES_C_1005X40]
R267  DNP/10k  [RES_C_1005X40]
R268  470k  [RES_C_1005X40]
R269  47k  [RES_C_1005X40]
R270  47k  [RES_C_1005X40]
R271  1k  [RES_C_1005X40]
R272  10k  [RES_C_1005X40]
R273  133k  [RES_C_1005X40]
R274  1.6k  [RES_C_1005X40]
U26  TPS259470ARPWR  [VQFN-HR-10]
U27  TPS259470ARPWR  [VQFN-HR-10]

### Blocks framed on the sheet
EFUSE for SLN & HD: C122-C127 D8 D15 JP10 R259-R266 U26
EFUSE for MOTOR: C128-C133 D9 D16 JP11 R267-R274 U27

### Nets
5V_EXP: C124.2 C125.2 JP10.1 R259.1 R260.2 R267.1 U26.5(IN)
5V_SLN_HD: D15.2(A)
5V_SLN_HD_eFuse: C122.2 C123.2 D8.1(K) JP10.2 R261.2 R262.2 U26.6(OUT)
12V_MOTOR: D16.2(A)
12V_MOTOR_eFuse: C128.2 C129.2 D9.1(K) JP11.2 R269.2 R270.2 U27.6(OUT)
GND: C122.1 C123.1 C124.1 C125.1 C126.1 C127.1 C128.1 C129.1 C130.1 C131.1 C132.1 C133.1 D8.2(A) D9.2(A) R263.1 R264.2 R265.1 R266.1 R271.1 R272.2 R273.1 R274.1 U26.8 U27.8
STX_12V: C130.2 C131.2 JP11.1 R268.2 U27.5(IN)
eFUSE_ILIM_5V_MOTOR: R274.2 U27.9 ; off-sheet eFUSE_ILIM_5V_MOTOR
eFUSE_ILIM_5V_SLN_HD: R266.2 U26.9 ; off-sheet eFUSE_ILIM_5V_SLN_HD
POW_ONOFF_MOTOR: R267.2 R272.1 U27.1(EN/UVLO) ; off-sheet POW_ONOFF_MOTOR
POW_ONOFF_SLN_HD: R259.2 R264.1 U26.1(EN/UVLO) ; off-sheet POW_ONOFF_SLN_HD
NetC126_2: C126.2 U26.10
NetC127_2: C127.2 U26.7
NetC132_2: C132.2 U27.10
NetC133_2: C133.2 U27.7
NetD15_1: D15.1(K) R263.2
NetD16_1: D16.1(K) R271.2
NetR260_1: R260.1 R265.2 U26.2(OVLO/OVCSEL)
NetR261_1: R261.1 U26.3(PG/AUXOFF)
NetR262_1: R262.1 U26.4(PGTH/~{FLT})
NetR268_1: R268.1 R273.2 U27.2(OVLO/OVCSEL)
NetR269_1: R269.1 U27.3(PG/AUXOFF)
NetR270_1: R270.1 U27.4(PGTH/~{FLT})

### Layout directives
net class POWER: 5V_EXP, 5V_SLN_HD_eFuse, 12V_MOTOR_eFuse, STX_12V

### Notes on the sheet
- Undervoltage Protector: NONE
- Overvoltage Protector: 1.2*(133+470)/133=5.44V
- Slew Rate: 2000/2200=0.91V/ms
- I-LIM: 3334/1600=2.08A
- Project
- Sub-system:
- Design by:
- Sheet title:
- Sheet:
- of
- Checked by:
- Approved by:
- Doc no:
- Revision
- Size:
- Date:

### Library data of the parts
C122-C124 C128-C130 = _CAP_C_High_2: CAP High Value
C125-C127 C131-C133 = _CAP_C_2: CAP
D8 D9 = DIODE SCHOTTKY
JP10 JP11 = JUMPER_1_1
R259-R274 = _RES_B_2: RES

## Sheet 08_MCU.SchDoc
size 420 x 297 mm; SheetNumber: 8; SheetTotal: 27
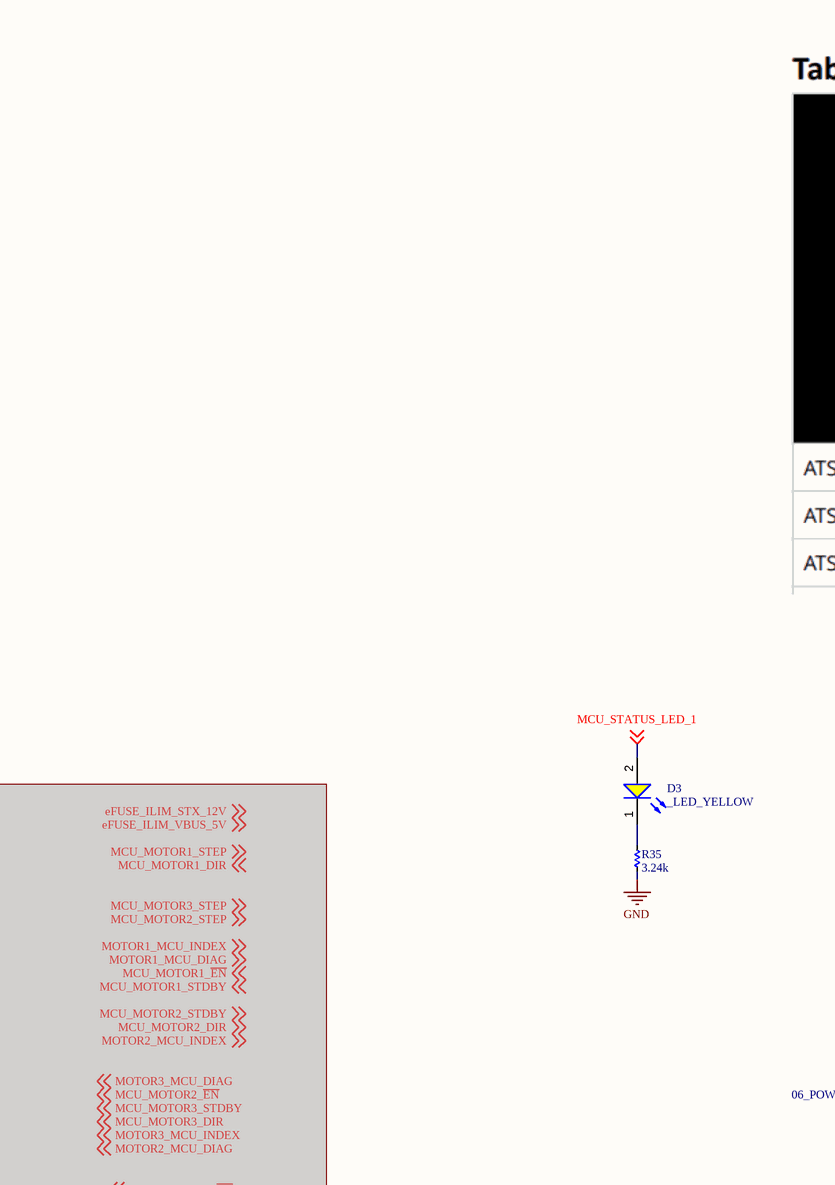
[diagram p7: 08_MCU.SchDoc, top left]
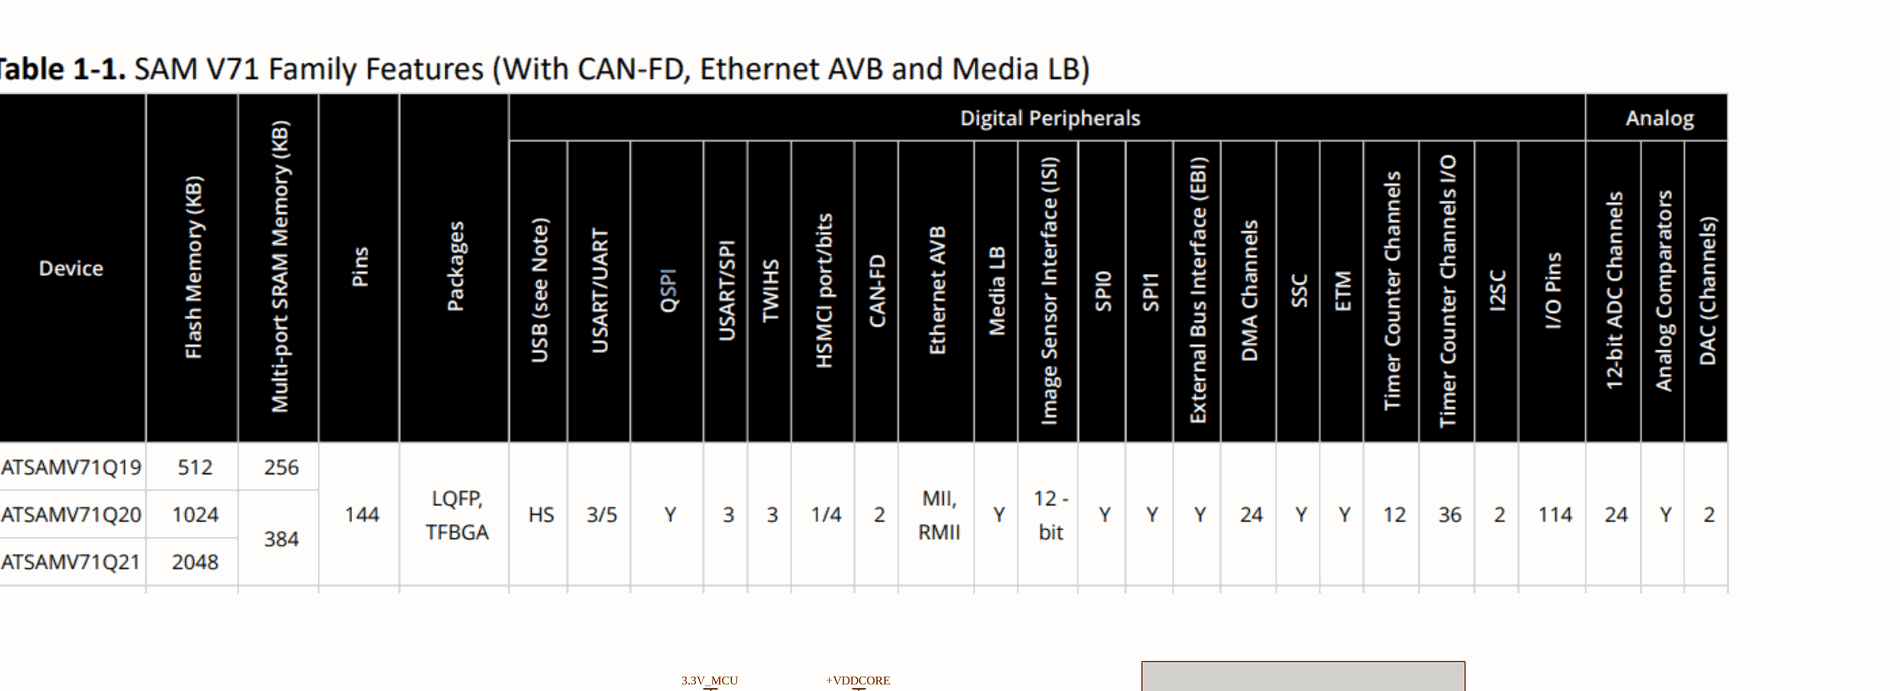
[diagram p8: 08_MCU.SchDoc, top right]
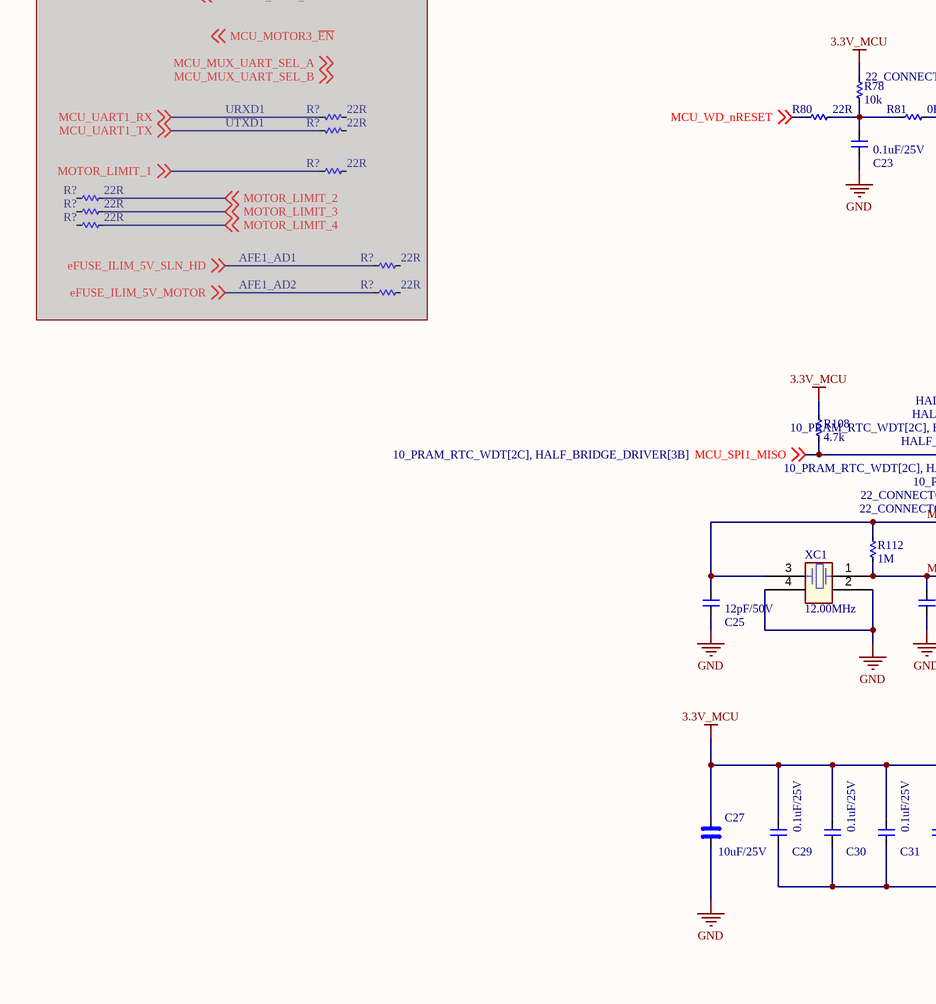
[diagram p9: 08_MCU.SchDoc, bottom left]
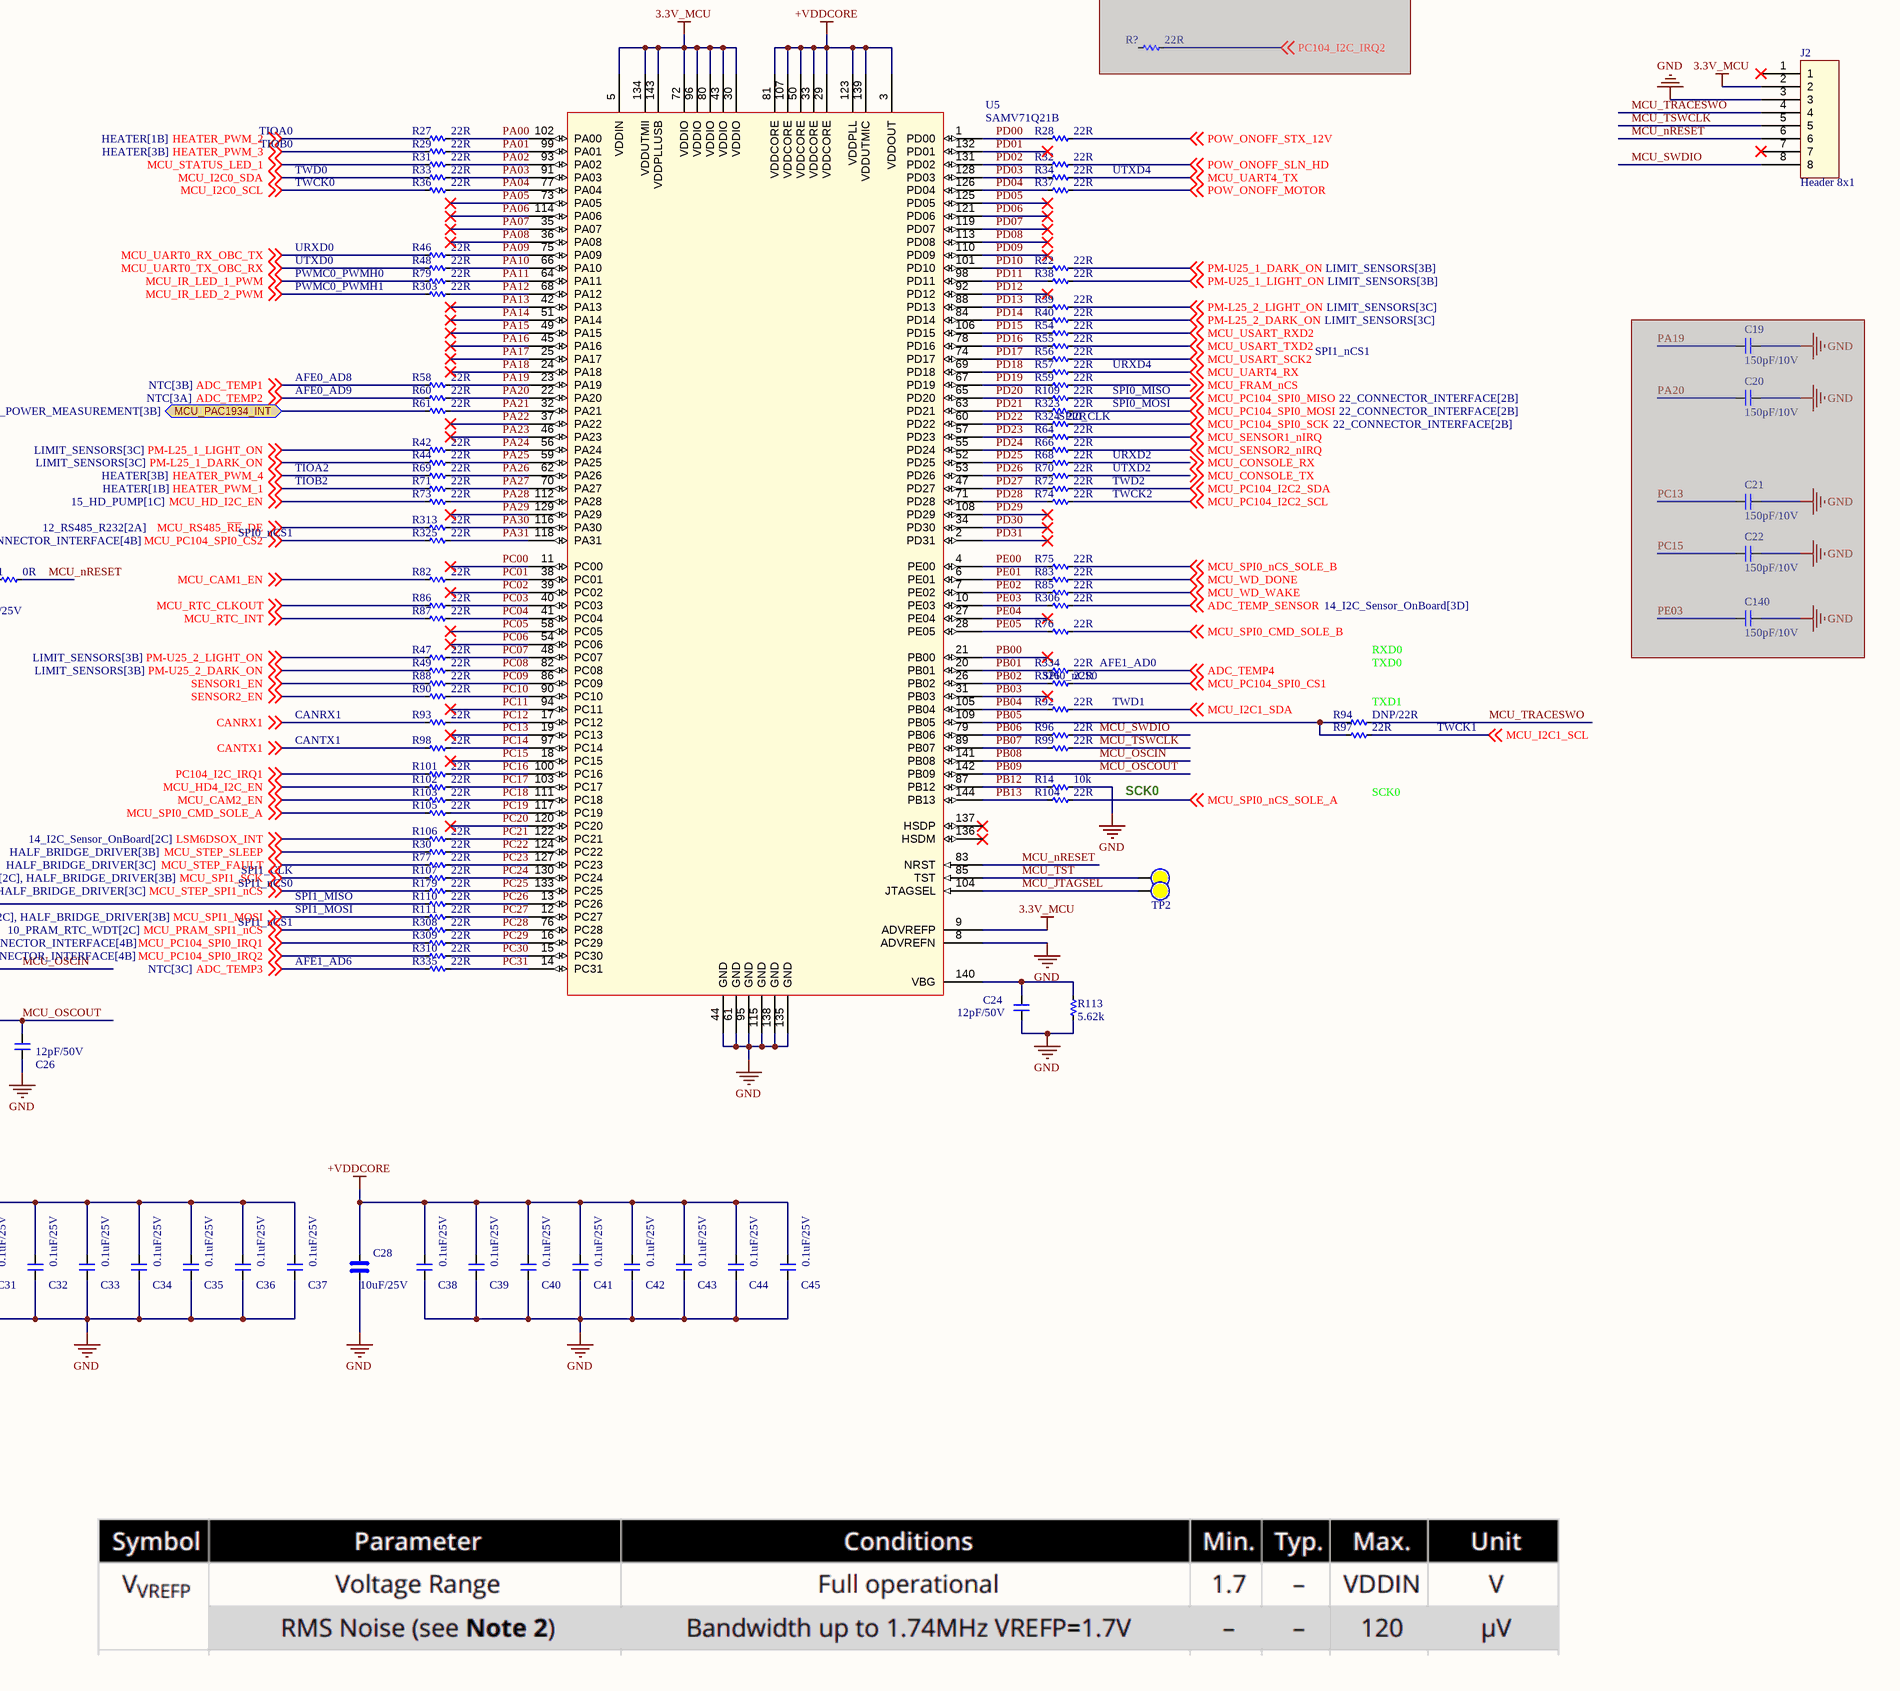
[diagram p10: 08_MCU.SchDoc, bottom right]

### Parts
(Parts that share a designator on the sheet are numbered #1, #2 ... from top to bottom, then left to right.)
C19#2  150pF/10V  [CAP_C_1005X60]  (masked out: inside a compile mask, not in the netlist)
C20#2  150pF/10V  [CAP_C_1005X60]  (masked out: inside a compile mask, not in the netlist)
C21#2  150pF/10V  [CAP_C_1005X60]  (masked out: inside a compile mask, not in the netlist)
C22#2  150pF/10V  [CAP_C_1005X60]  (masked out: inside a compile mask, not in the netlist)
C23  0.1uF/25V  [CAP_C_1005X60]
C24  12pF/50V  [CAP_C_1005X60]
C25  12pF/50V  [CAP_C_1005X60]
C26  12pF/50V  [CAP_C_1005X60]
C27  10uF/25V  [CAP_C_2012X110]
C28  10uF/25V  [CAP_C_2012X110]
C29  0.1uF/25V  [CAP_C_1005X60]
C30  0.1uF/25V  [CAP_C_1005X60]
C31  0.1uF/25V  [CAP_C_1005X60]
C32  0.1uF/25V  [CAP_C_1005X60]
C33  0.1uF/25V  [CAP_C_1005X60]
C34  0.1uF/25V  [CAP_C_1005X60]
C35  0.1uF/25V  [CAP_C_1005X60]
C36  0.1uF/25V  [CAP_C_1005X60]
C37  0.1uF/25V  [CAP_C_1005X60]
C38  0.1uF/25V  [CAP_C_1005X60]
C39  0.1uF/25V  [CAP_C_1005X60]
C40  0.1uF/25V  [CAP_C_1005X60]
C41  0.1uF/25V  [CAP_C_1005X60]
C42  0.1uF/25V  [CAP_C_1005X60]
C43  0.1uF/25V  [CAP_C_1005X60]
C44  0.1uF/25V  [CAP_C_1005X60]
C45  0.1uF/25V  [CAP_C_1005X60]
C140#1  150pF/10V  [CAP_C_1005X60]  (masked out: inside a compile mask, not in the netlist)
D3  _LED_YELLOW  [LED_0603]
J2  Header 8x1  [Header_254P_8x1]
R14  10k  [RES_C_1005X40]
R22  22R  [RES_C_1005X40]
R27  22R  [RES_C_1005X40]
R28  22R  [RES_C_1005X40]
R29  22R  [RES_C_1005X40]
R30  22R  [RES_C_1005X40]
R31  22R  [RES_C_1005X40]
R32  22R  [RES_C_1005X40]
R33  22R  [RES_C_1005X40]
R34  22R  [RES_C_1005X40]
R35  3.24k  [RES_C_1005X40]
R36  22R  [RES_C_1005X40]
R37  22R  [RES_C_1005X40]
R38  22R  [RES_C_1005X40]
R39  22R  [RES_C_1005X40]
R40  22R  [RES_C_1005X40]
R42  22R  [RES_C_1005X40]
R44  22R  [RES_C_1005X40]
R46  22R  [RES_C_1005X40]
R47  22R  [RES_C_1005X40]
R48  22R  [RES_C_1005X40]
R49  22R  [RES_C_1005X40]
R54  22R  [RES_C_1005X40]
R55  22R  [RES_C_1005X40]
R56  22R  [RES_C_1005X40]
R57  22R  [RES_C_1005X40]
R58  22R  [RES_C_1005X40]
R59  22R  [RES_C_1005X40]
R60  22R  [RES_C_1005X40]
R61  22R  [RES_C_1005X40]
R64  22R  [RES_C_1005X40]
R66  22R  [RES_C_1005X40]
R68  22R  [RES_C_1005X40]
R69  22R  [RES_C_1005X40]
R70  22R  [RES_C_1005X40]
R71  22R  [RES_C_1005X40]
R72  22R  [RES_C_1005X40]
R73  22R  [RES_C_1005X40]
R74  22R  [RES_C_1005X40]
R75  22R  [RES_C_1005X40]
R76  22R  [RES_C_1005X40]
R77#1  22R  [RES_C_1005X40]
R78  10k  [RES_C_1005X40]
R79  22R  [RES_C_1005X40]
R80  22R  [RES_C_1005X40]
R81  0R  [RES_C_1005X40]
R82  22R  [RES_C_1005X40]
R83  22R  [RES_C_1005X40]
R85  22R  [RES_C_1005X40]
R86  22R  [RES_C_1005X40]
R87  22R  [RES_C_1005X40]
R88  22R  [RES_C_1005X40]
R90  22R  [RES_C_1005X40]
R92  22R  [RES_C_1005X40]
R93  22R  [RES_C_1005X40]
R94  DNP/22R  [RES_C_1005X40]
R96  22R  [RES_C_1005X40]
R97  22R  [RES_C_1005X40]
R98  22R  [RES_C_1005X40]
R99  22R  [RES_C_1005X40]
R101  22R  [RES_C_1005X40]
R102  22R  [RES_C_1005X40]
R103  22R  [RES_C_1005X40]
R104  22R  [RES_C_1005X40]
R105  22R  [RES_C_1005X40]
R106  22R  [RES_C_1005X40]
R107  22R  [RES_C_1005X40]
R108  4.7k  [RES_C_1005X40]
R109  22R  [RES_C_1005X40]
R110  22R  [RES_C_1005X40]
R111  22R  [RES_C_1005X40]
R112  1M  [RES_C_1005X40]
R113  5.62k  [RES_C_1005X40]
R179#1  22R  [RES_C_1005X40]
R303  22R  [RES_C_1005X40]
R306  22R  [RES_C_1005X40]
R308  22R  [RES_C_1005X40]
R309  22R  [RES_C_1005X40]
R310  22R  [RES_C_1005X40]
R313  22R  [RES_C_1005X40]
R323  22R  [RES_C_1005X40]
R324  22R  [RES_C_1005X40]
R325  22R  [RES_C_1005X40]
R326  22R  [RES_C_1005X40]
R334  22R  [RES_C_1005X40]
R335  22R  [RES_C_1005X40]
R?#1  22R  [RES_C_1005X40]  (masked out: inside a compile mask, not in the netlist)
R?#2  22R  [RES_C_1005X40]  (masked out: inside a compile mask, not in the netlist)
R?#3  22R  [RES_C_1005X40]  (masked out: inside a compile mask, not in the netlist)
R?#4  22R  [RES_C_1005X40]  (masked out: inside a compile mask, not in the netlist)
R?#5  22R  [RES_C_1005X40]  (masked out: inside a compile mask, not in the netlist)
R?#6  22R  [RES_C_1005X40]  (masked out: inside a compile mask, not in the netlist)
R?#7  22R  [RES_C_1005X40]  (masked out: inside a compile mask, not in the netlist)
R?#8  22R  [RES_C_1005X40]  (masked out: inside a compile mask, not in the netlist)
R?#9  22R  [RES_C_1005X40]  (masked out: inside a compile mask, not in the netlist)
TP1  (no value)  [Testpoint_80]  (no BOM)
TP2  (no value)  [Testpoint_80]  (no BOM)
U5  SAMV71Q21B  [AP6-00118]
XC1  value 12.00MHz  [AP7-00039]  (hidden comment: FC5BQCCMC12.0-T1)

### Ports
MCU_PAC1934_INT (bidir, see 06_POWER_MEASUREMENT[3B])

### Nets
3.3V_MCU: C27.1 C29.2 C30.2 C31.2 C32.2 C33.2 C34.2 C35.2 C36.2 C37.2 J2.2 R78.2 R108.1 U5.5(VDDIN) U5.9(ADVREFP) U5.30(VDDIO) U5.43(VDDIO) U5.72(VDDIO) U5.80(VDDIO) U5.96(VDDIO) U5.134(VDDUTMII) U5.143(VDDPLLUSB)
+VDDCORE: C28.1 C38.2 C39.2 C40.2 C41.2 C42.2 C43.2 C44.2 C45.2 U5.3(VDDOUT) U5.29(VDDCORE) U5.33(VDDCORE) U5.50(VDDCORE) U5.81(VDDCORE) U5.107(VDDCORE) U5.123(VDDPLL) U5.139(VDDUTMIC)
GND: C23.1 C24.1 C25.1 C26.1 C27.2 C28.2 C29.1 C30.1 C31.1 C32.1 C33.1 C34.1 C35.1 C36.1 C37.1 C38.1 C39.1 C40.1 C41.1 C42.1 C43.1 C44.1 C45.1 J2.3 R14.1 R35.2 R113.1 U5.8(ADVREFN) U5.44(GND) U5.61(GND) U5.95(GND) U5.115(GND) U5.135(GND) U5.138(GND) XC1.2 XC1.4
ADC_TEMP1: R58.2 ; off-sheet ADC_TEMP1
ADC_TEMP2: R60.2 ; off-sheet ADC_TEMP2
ADC_TEMP3: R335.2 ; off-sheet ADC_TEMP3
ADC_TEMP4: R334.1 ; off-sheet ADC_TEMP4
ADC_TEMP_SENSOR: R306.1 ; off-sheet ADC_TEMP_SENSOR  [project net TEMP _SENSOR]
CANRX1: R93.2 ; off-sheet CANRX1
CANTX1: R98.2 ; off-sheet CANTX1
HEATER_PWM_1: R71.2 ; off-sheet HEATER_PWM_1
HEATER_PWM_2: R27.2 ; off-sheet HEATER_PWM_2
HEATER_PWM_3: R29.2 ; off-sheet HEATER_PWM_3
HEATER_PWM_4: R69.2 ; off-sheet HEATER_PWM_4
LSM6DSOX_INT: R106.2 ; off-sheet LSM6DSOX_INT
MCU_CAM1_EN: R82.2 ; off-sheet MCU_CAM1_EN
MCU_CAM2_EN: R103.2 ; off-sheet MCU_CAM2_EN
MCU_CONSOLE_RX: R68.1 ; off-sheet MCU_CONSOLE_RX
MCU_CONSOLE_TX: R70.1 ; off-sheet MCU_CONSOLE_TX
MCU_FRAM_nCS: R59.2 ; off-sheet MCU_FRAM_nCS
MCU_HD4_I2C_EN: R102.2 ; off-sheet MCU_HD4_I2C_EN
MCU_HD_I2C_EN: R73.2 ; off-sheet MCU_HD_I2C_EN
MCU_I2C0_SCL: R36.2 ; off-sheet MCU_I2C0_SCL
MCU_I2C0_SDA: R33.2 ; off-sheet MCU_I2C0_SDA
MCU_I2C1_SCL: R97.1 ; off-sheet MCU_I2C1_SCL
MCU_I2C1_SDA: R92.1 ; off-sheet MCU_I2C1_SDA
MCU_IR_LED_1_PWM: R79.2 ; off-sheet MCU_IR_LED_1_PWM
MCU_IR_LED_2_PWM: R303.2 ; off-sheet MCU_IR_LED_2_PWM
MCU_JTAGSEL: TP2.1 U5.104(JTAGSEL)
MCU_nRESET: J2.6 R81.1 U5.83(NRST)
MCU_OSCIN: C25.2 R112.2 U5.141(PB08) XC1.3  [also labelled PB08]
MCU_OSCOUT: C26.2 R112.1 U5.142(PB09) XC1.1  [also labelled PB09]
MCU_PC104_I2C2_SCL: R74.1 ; off-sheet MCU_PC104_I2C2_SCL
MCU_PC104_I2C2_SDA: R72.1 ; off-sheet MCU_PC104_I2C2_SDA
MCU_PC104_SPI0_CS1: R326.1 ; off-sheet MCU_PC104_SPI0_CS1
MCU_PC104_SPI0_CS2: R325.2 ; off-sheet MCU_PC104_SPI0_CS2
MCU_PC104_SPI0_IRQ1: R309.2 ; off-sheet MCU_PC104_SPI0_IRQ1
MCU_PC104_SPI0_IRQ2: R310.2 ; off-sheet MCU_PC104_SPI0_IRQ2
MCU_PC104_SPI0_MISO: R109.1 ; off-sheet MCU_PC104_SPI0_MISO
MCU_PC104_SPI0_MOSI: R323.1 ; off-sheet MCU_PC104_SPI0_MOSI
MCU_PC104_SPI0_SCK: R324.2 ; off-sheet MCU_PC104_SPI0_SCK
MCU_PRAM_SPI1_nCS: R308.2 ; off-sheet MCU_PRAM_SPI1_nCS
MCU_RS485_~{RE}_DE: R313.2 ; off-sheet MCU_RS485_~{RE}_DE
MCU_RTC_CLKOUT: R86.2 ; off-sheet MCU_RTC_CLKOUT
MCU_RTC_INT: R87.2 ; off-sheet MCU_RTC_INT
MCU_SENSOR1_nIRQ: R64.1 ; off-sheet MCU_SENSOR1_nIRQ
MCU_SENSOR2_nIRQ: R66.1 ; off-sheet MCU_SENSOR2_nIRQ
MCU_SPI0_CMD_SOLE_A: R105.2 ; off-sheet MCU_SPI0_CMD_SOLE_A
MCU_SPI0_CMD_SOLE_B: R76.1 ; off-sheet MCU_SPI0_CMD_SOLE_B
MCU_SPI0_nCS_SOLE_A: R104.1 ; off-sheet MCU_SPI0_nCS_SOLE_A
MCU_SPI0_nCS_SOLE_B: R75.1 ; off-sheet MCU_SPI0_nCS_SOLE_B
MCU_SPI1_MISO: R108.2 R110.2 ; off-sheet MCU_SPI1_MISO
MCU_SPI1_MOSI: R111.2 ; off-sheet MCU_SPI1_MOSI
MCU_SPI1_SCK: R107.2 ; off-sheet MCU_SPI1_SCK
MCU_STATUS_LED_1: D3.2(A) R31.1 ; off-sheet MCU_STATUS_LED_1
MCU_STEP_FAULT: R77#1.2 ; off-sheet MCU_STEP_FAULT
MCU_STEP_SLEEP: R30.2 ; off-sheet MCU_STEP_SLEEP
MCU_STEP_SPI1_nCS: R179#1.2 ; off-sheet MCU_STEP_SPI1_nCS
MCU_SWDIO: J2.8 R96.1
MCU_TRACESWO: J2.4 R94.1
MCU_TST: TP1.1 U5.85(TST)
MCU_TSWCLK: J2.5 R99.1
MCU_UART0_RX_OBC_TX: R46.2 ; off-sheet MCU_UART0_RX_OBC_TX
MCU_UART0_TX_OBC_RX: R48.2 ; off-sheet MCU_UART0_TX_OBC_RX
MCU_UART4_RX: R57.1 ; off-sheet MCU_UART4_RX
MCU_UART4_TX: R34.1 ; off-sheet MCU_UART4_TX
MCU_USART_RXD2: R54.1 ; off-sheet MCU_USART_RXD2
MCU_USART_SCK2: R56.1 ; off-sheet MCU_USART_SCK2
MCU_USART_TXD2: R55.1 ; off-sheet MCU_USART_TXD2
MCU_WD_DONE: R83.1 ; off-sheet MCU_WD_DONE
MCU_WD_nRESET: R80.2 ; off-sheet MCU_WD_nRESET
MCU_WD_WAKE: R85.1 ; off-sheet MCU_WD_WAKE
PA00: R27.1 U5.102(PA00)
PA01: R29.1 U5.99(PA01)
PA02: R31.2 U5.93(PA02)
PA03: R33.1 U5.91(PA03)
PA04: R36.1 U5.77(PA04)
PA05: U5.73(PA05)
PA06: U5.114(PA06)
PA07: U5.35(PA07)
PA08: U5.36(PA08)
PA09: R46.1 U5.75(PA09)
PA10: R48.1 U5.66(PA10)
PA11: R79.1 U5.64(PA11)
PA12: R303.1 U5.68(PA12)
PA13: U5.42(PA13)
PA14: U5.51(PA14)
PA15: U5.49(PA15)
PA16: U5.45(PA16)
PA17: U5.25(PA17)
PA18: U5.24(PA18)
PA19: R58.1 U5.23(PA19)
PA20: R60.1 U5.22(PA20)
PA21: R61.1 U5.32(PA21)
PA22: U5.37(PA22)
PA23: U5.46(PA23)
PA24: R42.1 U5.56(PA24)
PA25: R44.1 U5.59(PA25)
PA26: R69.1 U5.62(PA26)
PA27: R71.1 U5.70(PA27)
PA28: R73.1 U5.112(PA28)
PA29: U5.129(PA29)
PA30: R313.1 U5.116(PA30)
PA31: R325.1 U5.118(PA31)
PB00: U5.21(PB00)
PB01: R334.2 U5.20(PB01)
PB02: R326.2 U5.26(PB02)
PB03: U5.31(PB03)
PB04: R92.2 U5.105(PB04)
PB05: R94.2 R97.2 U5.109(PB05)
PB06: R96.2 U5.79(PB06)
PB07: R99.2 U5.89(PB07)
PB12: R14.2 U5.87(PB12)
PB13: R104.2 U5.144(PB13)
PC00: U5.11(PC00)
PC01: R82.1 U5.38(PC01)
PC02: U5.39(PC02)
PC03: R86.1 U5.40(PC03)
PC04: R87.1 U5.41(PC04)
PC05: U5.58(PC05)
PC06: U5.54(PC06)
PC07: R47.1 U5.48(PC07)
PC08: R49.1 U5.82(PC08)
PC09: R88.1 U5.86(PC09)
PC10: R90.1 U5.90(PC10)
PC11: U5.94(PC11)
PC12: R93.1 U5.17(PC12)
PC13: U5.19(PC13)
PC14: R98.1 U5.97(PC14)
PC15: U5.18(PC15)
PC16: R101.1 U5.100(PC16)
PC17: R102.1 U5.103(PC17)
PC18: R103.1 U5.111(PC18)
PC19: R105.1 U5.117(PC19)
PC20: U5.120(PC20)
PC21: R106.1 U5.122(PC21)
PC22: R30.1 U5.124(PC22)
PC23: R77#1.1 U5.127(PC23)
PC24: R107.1 U5.130(PC24)
PC25: R179#1.1 U5.133(PC25)
PC26: R110.1 U5.13(PC26)
PC27: R111.1 U5.12(PC27)
PC28: R308.1 U5.76(PC28)
PC29: R309.1 U5.16(PC29)
PC30: R310.1 U5.15(PC30)
PC31: R335.1 U5.14(PC31)
PC104_I2C_IRQ1: R101.2 ; off-sheet PC104_I2C_IRQ1
PD00: R28.2 U5.1(PD00)
PD01: U5.132(PD01)
PD02: R32.2 U5.131(PD02)
PD03: R34.2 U5.128(PD03)
PD04: R37.2 U5.126(PD04)
PD05: U5.125(PD05)
PD06: U5.121(PD06)
PD07: U5.119(PD07)
PD08: U5.113(PD08)
PD09: U5.110(PD09)
PD10: R22.2 U5.101(PD10)
PD11: R38.2 U5.98(PD11)
PD12: U5.92(PD12)
PD13: R39.2 U5.88(PD13)
PD14: R40.2 U5.84(PD14)
PD15: R54.2 U5.106(PD15)
PD16: R55.2 U5.78(PD16)
PD17: R56.2 U5.74(PD17)
PD18: R57.2 U5.69(PD18)
PD19: R59.1 U5.67(PD19)
PD20: R109.2 U5.65(PD20)
PD21: R323.2 U5.63(PD21)
PD22: R324.1 U5.60(PD22)
PD23: R64.2 U5.57(PD23)
PD24: R66.2 U5.55(PD24)
PD25: R68.2 U5.52(PD25)
PD26: R70.2 U5.53(PD26)
PD27: R72.2 U5.47(PD27)
PD28: R74.2 U5.71(PD28)
PD29: U5.108(PD29)
PD30: U5.34(PD30)
PD31: U5.2(PD31)
PE00: R75.2 U5.4(PE00)
PE01: R83.2 U5.6(PE01)
PE02: R85.2 U5.7(PE02)
PE03: R306.2 U5.10(PE03)
PE04: U5.27(PE04)
PE05: R76.2 U5.28(PE05)
PM-L25_1_DARK_ON: R44.2 ; off-sheet PM-L25_1_DARK_ON
PM-L25_1_LIGHT_ON: R42.2 ; off-sheet PM-L25_1_LIGHT_ON
PM-L25_2_DARK_ON: R40.1 ; off-sheet PM-L25_2_DARK_ON
PM-L25_2_LIGHT_ON: R39.1 ; off-sheet PM-L25_2_LIGHT_ON
PM-U25_1_DARK_ON: R22.1 ; off-sheet PM-U25_1_DARK_ON
PM-U25_1_LIGHT_ON: R38.1 ; off-sheet PM-U25_1_LIGHT_ON
PM-U25_2_DARK_ON: R49.2 ; off-sheet PM-U25_2_DARK_ON
PM-U25_2_LIGHT_ON: R47.2 ; off-sheet PM-U25_2_LIGHT_ON
POW_ONOFF_MOTOR: R37.1 ; off-sheet POW_ONOFF_MOTOR
POW_ONOFF_SLN_HD: R32.1 ; off-sheet POW_ONOFF_SLN_HD
POW_ONOFF_STX_12V: R28.1 ; off-sheet POW_ONOFF_STX_12V
SENSOR1_EN: R88.2 ; off-sheet SENSOR1_EN
SENSOR2_EN: R90.2 ; off-sheet SENSOR2_EN
NetC23_2: C23.2 R78.1 R80.1 R81.2
NetC24_2: C24.2 R113.2 U5.140(VBG)
NetD3_1: D3.1(K) R35.1
NetR61_2: R61.2 ; port MCU_PAC1934_INT

Not connected (* = marked no-connect by the designer): J2 1* 7*; U5 136(HSDM)* 137(HSDP)*

### Notes on the sheet
- TIOA0
- TWD0
- TWCK0
- TIOB0
- UTXD4
- URXD0
- UTXD0
- PWMC0_PWMH0
- PWMC0_PWMH1
- AFE0_AD8
- AFE0_AD9
- URXD4
- SPI0_MISO
- SPI1_nCS1
- URXD2
- SPI0_MOSI
- SPI0_CLK
- TIOB2
- TIOA2
- TWD2
- TWCK2
- UTXD2
- URXD1
- UTXD1
- SPI0_nCS1
- RXD0
- AFE1_AD1
- CANRX1
- SPI0_nCS0
- AFE1_AD0
- TWD1
- TXD0
- (near R94) TXD1
- AFE1_AD2
- CANTX1
- TWCK1
- SCK0
- SPI1_MISO
- SPI1_MOSI
- SPI1_CLK
- SPI1_nCS0
- AFE1_AD6
- Project
- Sub-system:
- Design by:
- Sheet title:
- Sheet:
- of
- Checked by:
- Approved by:
- Doc no:
- Revision
- Size:
- Date:

### Library data of the parts
C19#2 C20#2 C21#2 C22#2 C23-C26 C29-C45 C140#1 = _CAP_C_2: CAP
C27 C28 = _CAP_C_High_2: CAP High Value
R14 R22 R27-R40 R42 R44 R46-R49 R54-R61 R64 R66 R68-R76 R77#1 R78-R83 R85-R88 R90 R92-R94 R96-R99 R101-R113 R179#1 R303 R306 R308-R310 R313 R323-R326 R334 R335 R?#1-R?#9 = _RES_B_2: RES
TP1 TP2 = Test Point: Solder: NF
U5 = SAMV71Q21B: SAM 32-bit ARM Cortex-M* RISC MCU, SAMV71B Series, QFP144; PartGroup: Integrated Circuits,MCU, MPU, DSP,ARM MCU; Manufacturer: MICROCHIP; MPN: ATSAMV71Q21B-AAB; AN: A06-1541; TemperatureRange: -40Â°C to +105Â°C; Height: 1,60000002384186; Value: SAMV71Q21B
XC1 = A07-0042: Fox FQ5032B 12.0MHz SMD crystal 738B-12; PartGroup: Frequency devices,Crystals,SMD; Manufacturer: Fox  Electronics; MPN: FQ5032B-12.000; Tolerance: Â±30ppm; TemperatureRange: 0Â°C ~ 70Â°C; AN: A07-0042; Height: 1,20000004768372

## Sheet 09_CAN.SchDoc
size 420 x 297 mm; SheetNumber: 9; SheetTotal: 27
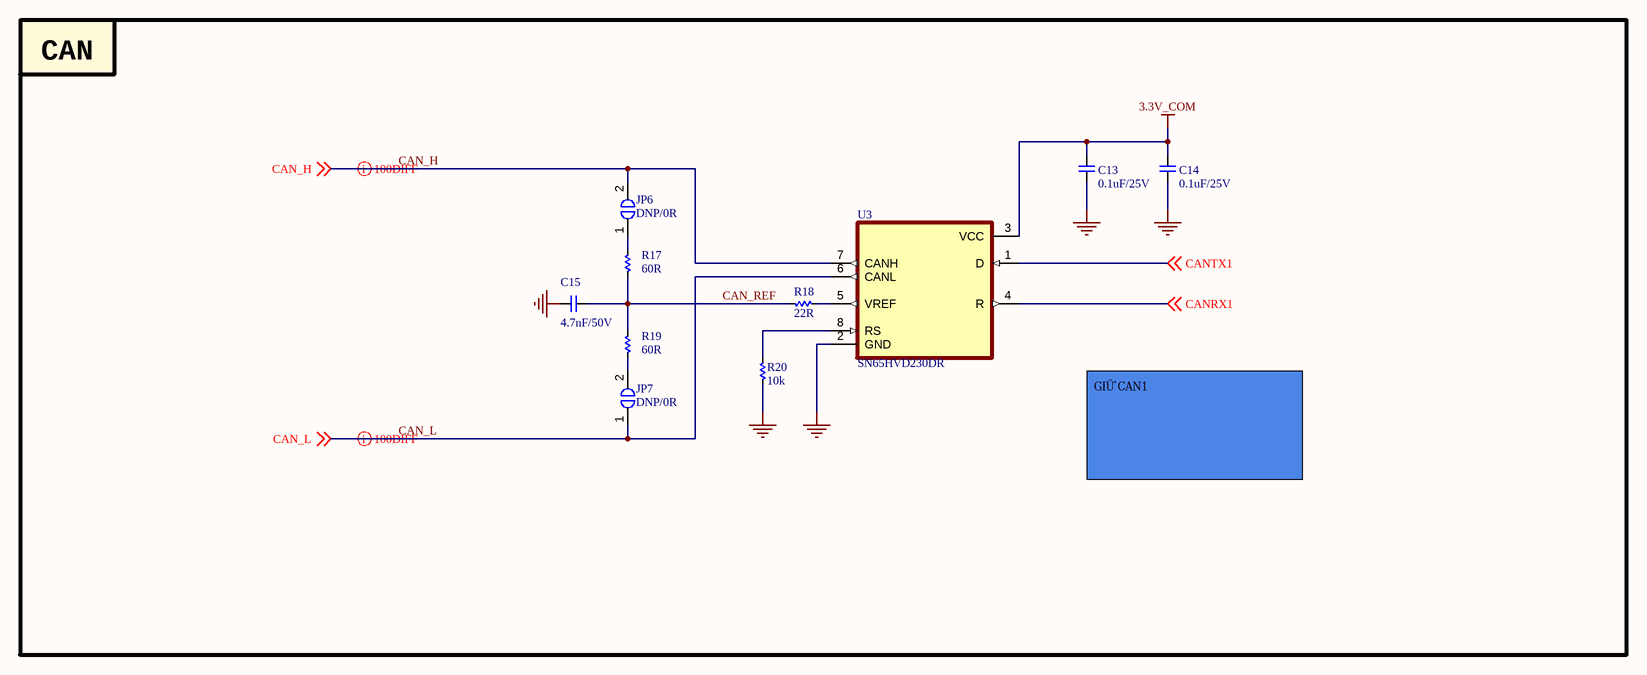
[diagram p11: 09_CAN.SchDoc]

### Parts
C13  0.1uF/25V  [CAP_C_1005X60]
C14  0.1uF/25V  [CAP_C_1005X60]
C15  4.7nF/50V  [CAP_C_1608X80]
JP6  DNP/0R  [RES_C_1608X60]
JP7  DNP/0R  [RES_C_1608X60]
R17  60R  [RES_C_1005X40]
R18  22R  [RES_C_1005X40]
R19  60R  [RES_C_1005X40]
R20  10k  [RES_C_1005X40]
U3  SN65HVD230DR  [SOIC127P600X175-8N]

### Blocks framed on the sheet
CAN: C13-C15 JP6 JP7 R17-R20 U3

### Nets
3.3V_COM: C13.1 C14.1 U3.3(VCC)
GND: C13.2 C14.2 C15.2 R20.1 U3.2(GND)
CAN_H: JP6.2 U3.7(CANH) ; off-sheet CAN_H
CAN_L: JP7.1 U3.6(CANL) ; off-sheet CAN_L
CAN_REF: C15.1 R17.1 R18.1 R19.2
CANRX1: U3.4(R) ; off-sheet CANRX1
CANTX1: U3.1(D) ; off-sheet CANTX1
NetJP6_1: JP6.1 R17.2
NetJP7_2: JP7.2 R19.1
NetR18_2: R18.2 U3.5(VREF)
NetR20_2: R20.2 U3.8(RS)

### Layout directives
differential pair; differential pair class DIFF100: CAN_H, CAN_L

### Notes on the sheet
- GIỮ CAN1
- Project
- Sub-system:
- Design by:
- Sheet title:
- Sheet:
- of
- Checked by:
- Approved by:
- Doc no:
- Revision
- Size:
- Date:

### Library data of the parts
C13-C15 = _CAP_C_2: CAP
JP6 JP7 = JUMPER_1_1
R17-R20 = _RES_B_2: RES
U3 = SN65HVD230DR: 3.3 V CAN Transceiver with Standby Mode; MF: Texas Instruments; SnapEDA_Link: https://www.snapeda.com/parts/SN65HVD230DR/Texas+Instruments/view-part/?ref=snap; Package: SOIC-8 Texas Instruments; Value: *; MP: SN65HVD230DR; Check_prices: https://www.snapeda.com/parts/SN65HVD230DR/Texas+Instruments/view-part/?ref=eda

## Sheet 10_PRAM_RTC_WDT.SchDoc
size 420 x 297 mm; SheetNumber: 10; SheetTotal: 27
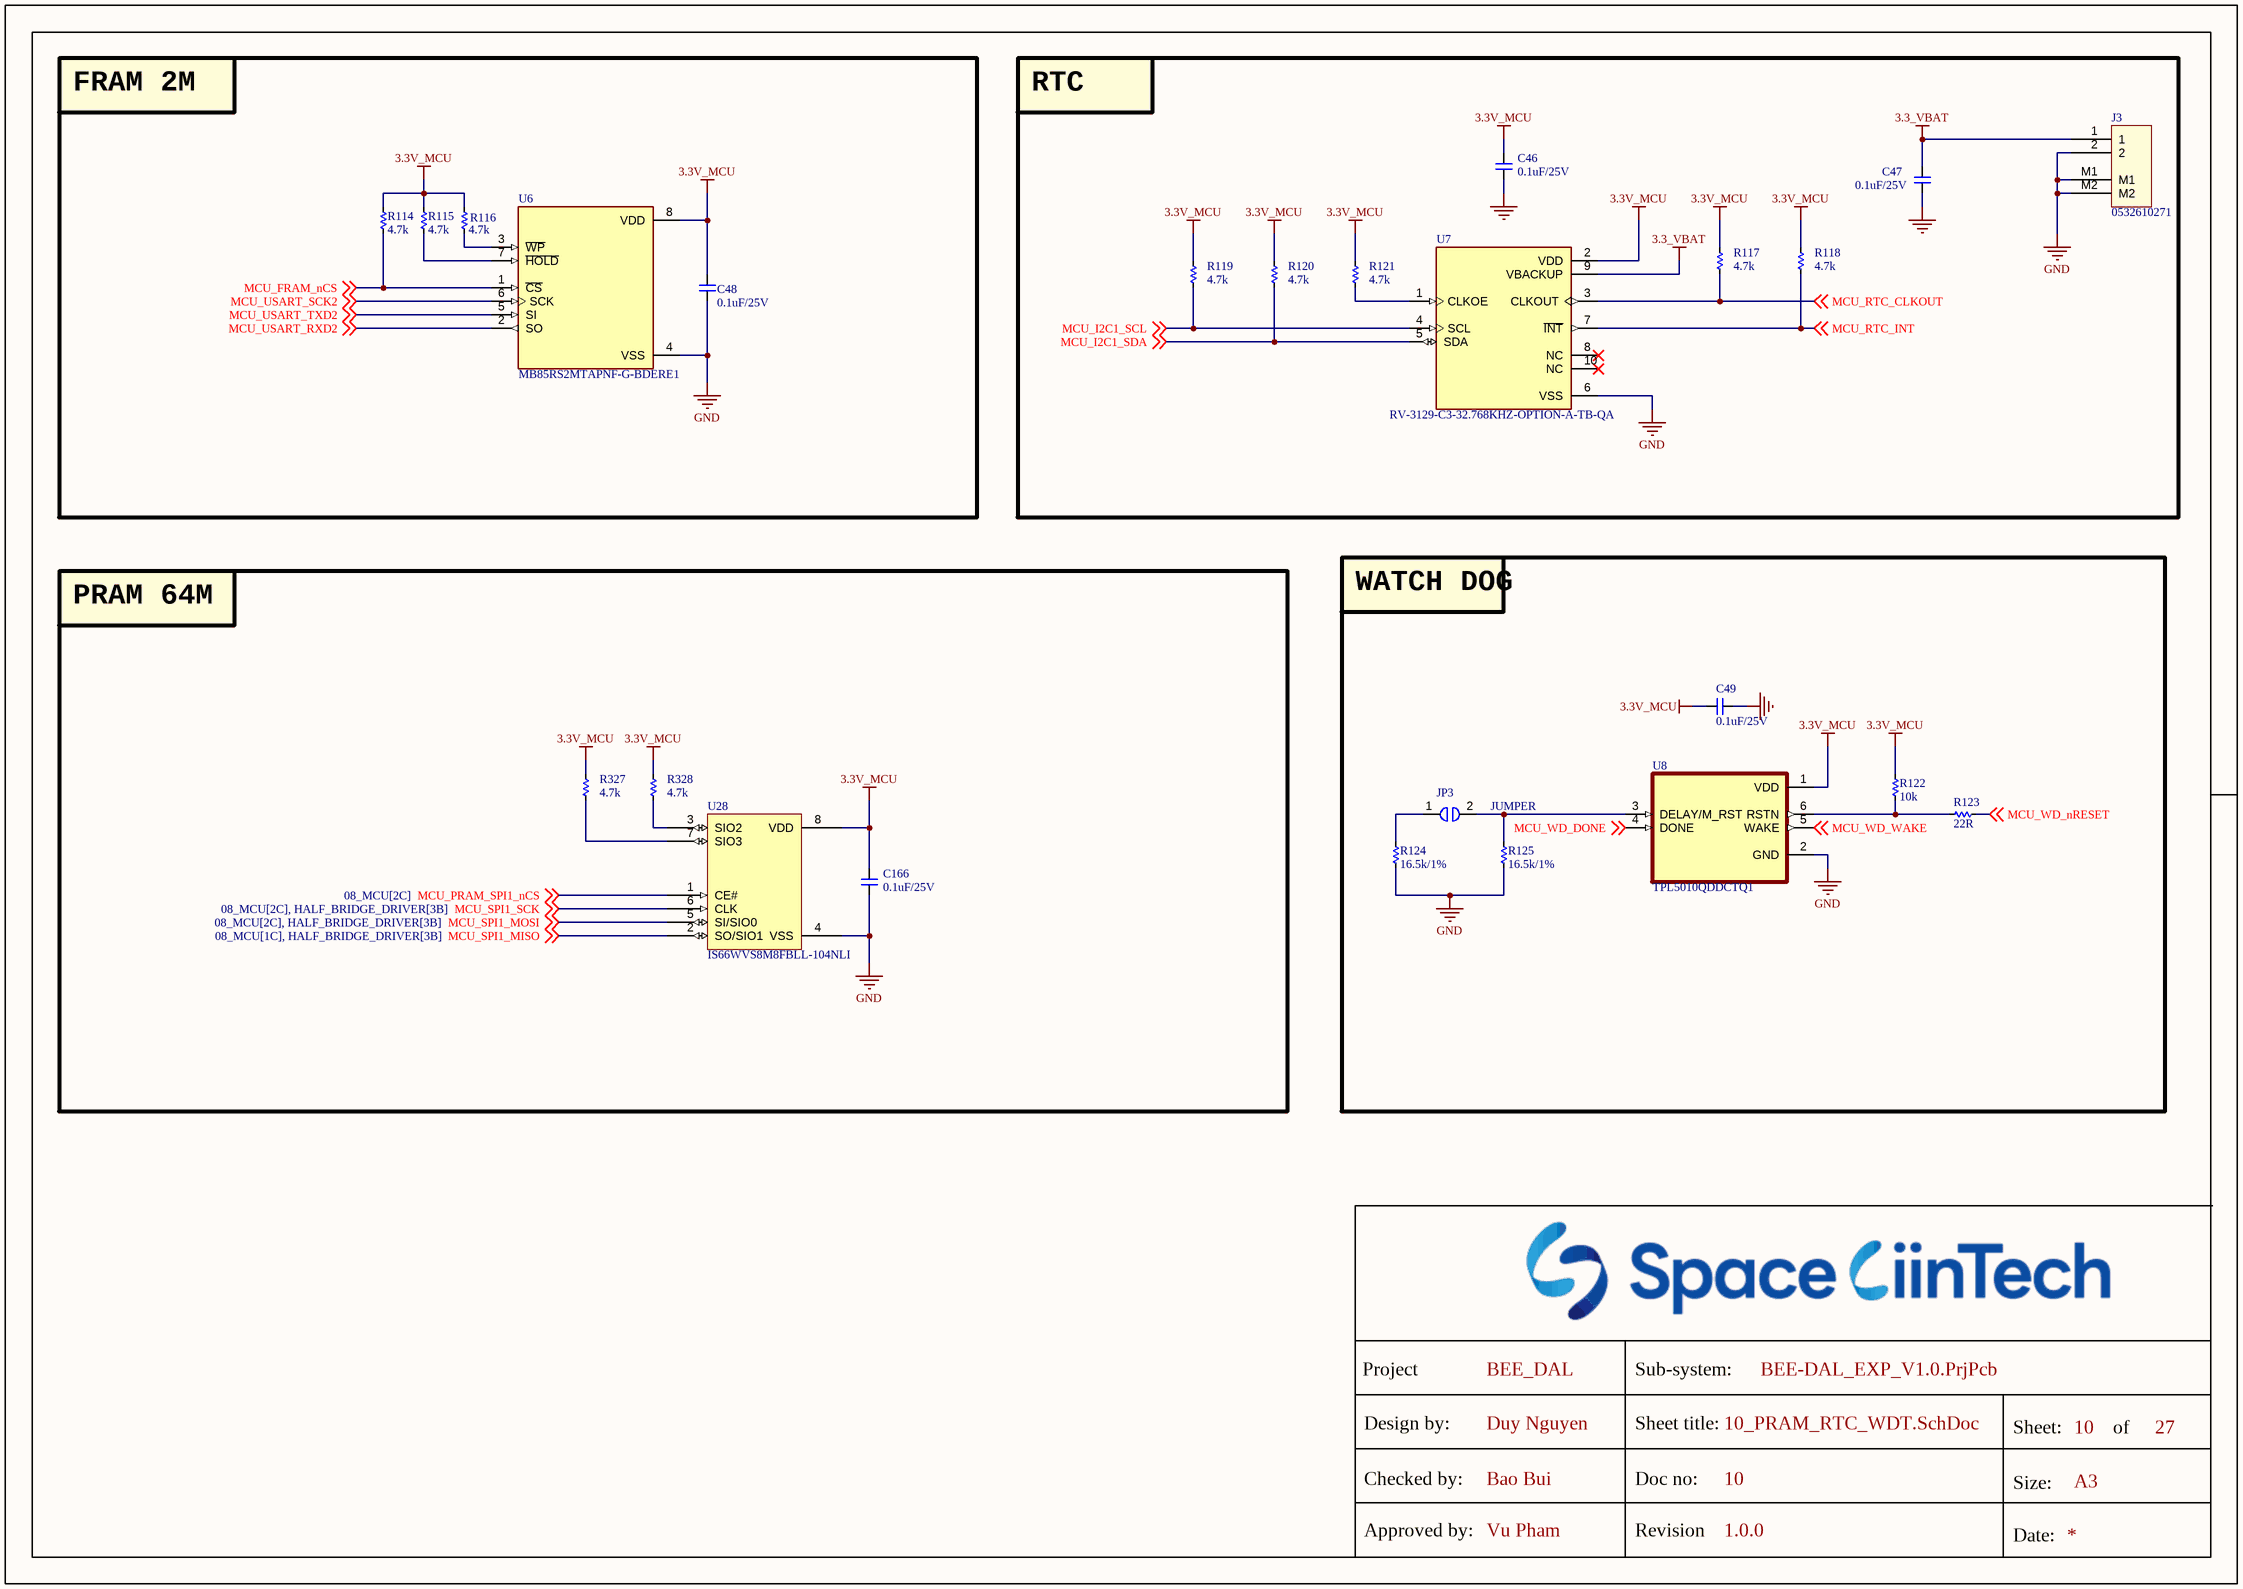
[diagram p12: 10_PRAM_RTC_WDT.SchDoc]

### Parts
(Parts that share a designator on the sheet are numbered #1, #2 ... from top to bottom, then left to right.)
C46  0.1uF/25V  [CAP_C_1005X60]
C47  0.1uF/25V  [CAP_C_1005X60]
C48  0.1uF/25V  [CAP_C_1005X60]
C49  0.1uF/25V  [CAP_C_1005X60]
C166  0.1uF/25V  [CAP_C_1005X60]
J3  0532610271  [MOLEX_0532610271]
JP3  JUMPER  [JUMPER_1608]
R114  4.7k  [RES_C_1005X40]
R115  4.7k  [RES_C_1005X40]
R116  4.7k  [RES_C_1005X40]
R117  4.7k  [RES_C_1005X40]
R118  4.7k  [RES_C_1005X40]
R119  4.7k  [RES_C_1005X40]
R120  4.7k  [RES_C_1005X40]
R121  4.7k  [RES_C_1005X40]
R122  10k  [RES_C_1005X40]
R123  22R  [RES_C_1005X40]
R124  16.5k/1%  [RES_C_1005X40]
R125  16.5k/1%  [RES_C_1005X40]
R327  4.7k  [RES_C_1005X40]
R328  4.7k  [RES_C_1005X40]
U6  MB85RS2MTAPNF-G-BDERE1  [SOIC127P602X173-8N]
U7  RV-3129-C3-32.768KHZ-OPTION-A-TB-QA  [IC_RV-3129-C3_32.768KHZ_OPTION_A_TB_QA]
U8  TPL5010QDDCTQ1  [SOT95P280X145-6N]
U28#1  IS66WVS8M8FBLL-104NLI  [SOIC8_150MIL_N_ISI]

### Blocks framed on the sheet
FRAM 2M: C48 R114-R116 U6
RTC: C46 C47 J3 R117-R121 U7
PRAM 64M: C166 R327 R328 U28#1
WATCH DOG: C49 JP3 R122-R125 U8

### Nets
3.3_VBAT: C47.2 J3.1 U7.9(VBACKUP)
3.3V_MCU: C46.2 C48.2 C49.2 C166.1 R114.2 R115.2 R116.2 R117.2 R118.2 R119.2 R120.2 R121.1 R122.2 R327.2 R328.2 U6.8(VDD) U7.2(VDD) U8.1(VDD) U28#1.8(VDD)
GND: C46.1 C47.1 C48.1 C49.1 C166.2 J3.2 J3.M1 J3.M2 R124.1 R125.1 U6.4(VSS) U7.6(VSS) U8.2(GND) U28#1.4(VSS)
MCU_FRAM_nCS: R114.1 U6.1(~{CS}) ; off-sheet MCU_FRAM_nCS
MCU_I2C1_SCL: R119.1 U7.4(SCL) ; off-sheet MCU_I2C1_SCL
MCU_I2C1_SDA: R120.1 U7.5(SDA) ; off-sheet MCU_I2C1_SDA
MCU_PRAM_SPI1_nCS: U28#1.1(CE#) ; off-sheet MCU_PRAM_SPI1_nCS
MCU_RTC_CLKOUT: R117.1 U7.3(CLKOUT) ; off-sheet MCU_RTC_CLKOUT
MCU_RTC_INT: R118.1 U7.7(~{INT}) ; off-sheet MCU_RTC_INT
MCU_SPI1_MISO: U28#1.2(SO/SIO1) ; off-sheet MCU_SPI1_MISO
MCU_SPI1_MOSI: U28#1.5(SI/SIO0) ; off-sheet MCU_SPI1_MOSI
MCU_SPI1_SCK: U28#1.6(CLK) ; off-sheet MCU_SPI1_SCK
MCU_USART_RXD2: U6.2(SO) ; off-sheet MCU_USART_RXD2
MCU_USART_SCK2: U6.6(SCK) ; off-sheet MCU_USART_SCK2
MCU_USART_TXD2: U6.5(SI) ; off-sheet MCU_USART_TXD2
MCU_WD_DONE: U8.4(DONE) ; off-sheet MCU_WD_DONE
MCU_WD_nRESET: R123.1 ; off-sheet MCU_WD_nRESET
MCU_WD_WAKE: U8.5(WAKE) ; off-sheet MCU_WD_WAKE
NetJP3_1: JP3.1 R124.2
NetJP3_2: JP3.2 R125.2 U8.3(DELAY/M_RST)
NetR115_1: R115.1 U6.7(~{HOLD})
NetR116_1: R116.1 U6.3(~{WP})
NetR121_2: R121.2 U7.1(CLKOE)
NetR122_1: R122.1 R123.2 U8.6(RSTN)
NetR327_1: R327.1 U28#1.7(SIO3)
NetR328_1: R328.1 U28#1.3(SIO2)

Not connected (* = marked no-connect by the designer): U7 8(NC)* 10(NC)*

### Notes on the sheet
- Project
- Sub-system:
- Design by:
- Sheet title:
- Sheet:
- of
- Checked by:
- Approved by:
- Doc no:
- Revision
- Size:
- Date:

### Library data of the parts
C46-C49 C166 = _CAP_C_2: CAP
J3 = Header 2x1_2M
JP3 = JUMPER_1_1
R114-R125 R327 R328 = _RES_B_2: RES
U6 = MB85RS2MTAPNF-G-BDERE1: FRAM _Ferroelectric RAM_ Memory IC 2Mb _256K x 8_ SPI 40MHz 8-SOP; MF: Fujitsu Electronics; Package: SO-8 Fujitsu; Value: *; Digi-Key_Purchase_URL: https://www.digikey.com/product-detail/en/fujitsu-electronics-america-inc/MB85RS2MTAPNF-G-BDERE1/865-1286-1-ND/7916252?utm_source=snapeda&utm_medium=aggregator&utm_campaign=symbol; Digi-Key_Part_Number: 865-1286-1-ND; SnapEDA_Link: https://www.snapeda.com/parts/MB85RS2MTAPNF-G-BDERE1/Fujitsu%20Electronics%20America%2C%20Inc./view-part/2344795/?ref=snap; MP: MB85RS2MTAPNF-G-BDERE1
U7 = RV-3129-C3_32.768KHZ_OPTION_A_TB_QA: Real-Time Clock Module, Temperature compensated, in 2.5 x 3.7 mm package; MF: Micro Crystal; MP: RV-3129-C3 32.768KHZ OPTION A TB QA; SnapEDA_Link: https://www.snapeda.com/parts/RV-3129-C3%2032.768KHZ%20OPTION%20A%20TB%20QA/Micro+Crystal/view-part/?ref=snap; Package: QFN-10 Micro Crystal; Value: *; Check_prices: https://www.snapeda.com/parts/RV-3129-C3%2032.768KHZ%20OPTION%20A%20TB%20QA/Micro+Crystal/view-part/?ref=eda
U28#1 = IS66WVS4M8BLL-104NLI: No Description Available; Manufacturer_Name: ISSI; Type: Memory; Copyright: Copyright (C) 2025 Ultra Librarian. All rights reserved.; Manufacturer_Part_Number: IS66WVS4M8BLL-104NLI; RefDes: RefDes
U8 = TPL5010QDDCTQ1: Package: None; Price: None; Value: *; MP: TPL5010QDDCTQ1; Availability: Unavailable

## Sheet 11_CONSOLE.SchDoc
size 420 x 297 mm; SheetNumber: 11; SheetTotal: 27
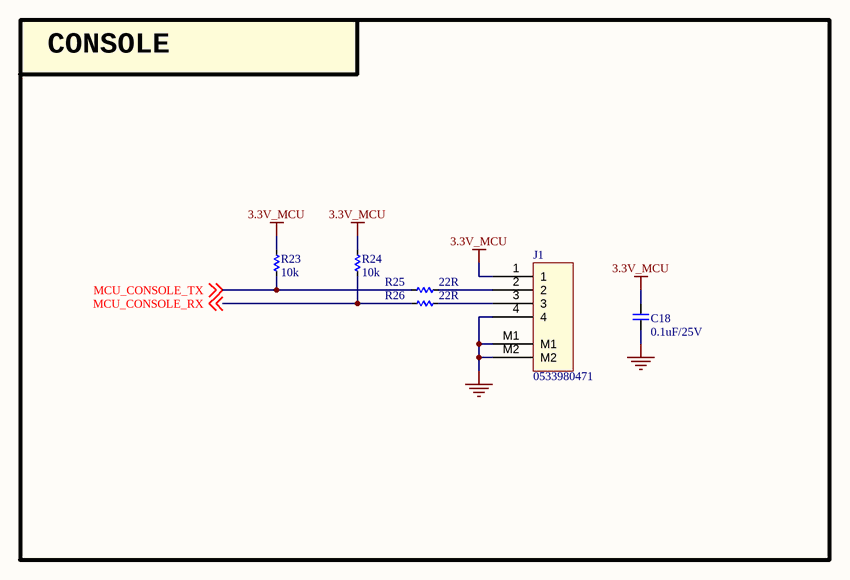
[diagram p13: 11_CONSOLE.SchDoc]

### Parts
C18  0.1uF/25V  [CAP_C_1005X60]
J1  0533980471  [MOLEX_0533980471]
R23  10k  [RES_C_1005X40]
R24  10k  [RES_C_1005X40]
R25  22R  [RES_C_1005X40]
R26  22R  [RES_C_1005X40]

### Blocks framed on the sheet
CONSOLE: C18 J1 R23-R26

### Nets
3.3V_MCU: C18.2 J1.1 R23.2 R24.2
GND: C18.1 J1.4 J1.M1 J1.M2
MCU_CONSOLE_RX: R24.1 R26.2 ; off-sheet MCU_CONSOLE_RX
MCU_CONSOLE_TX: R23.1 R25.2 ; off-sheet MCU_CONSOLE_TX
NetJ1_2: J1.2 R25.1
NetJ1_3: J1.3 R26.1

### Notes on the sheet
- Project
- Sub-system:
- Design by:
- Sheet title:
- Sheet:
- of
- Checked by:
- Approved by:
- Doc no:
- Revision
- Size:
- Date:

### Library data of the parts
C18 = _CAP_C_2: CAP
J1 = Header 4x1_2M
R23-R26 = _RES_B_2: RES

## Sheet 12_RS485_R232.SchDoc
size 420 x 297 mm; SheetNumber: 12; SheetTotal: 27
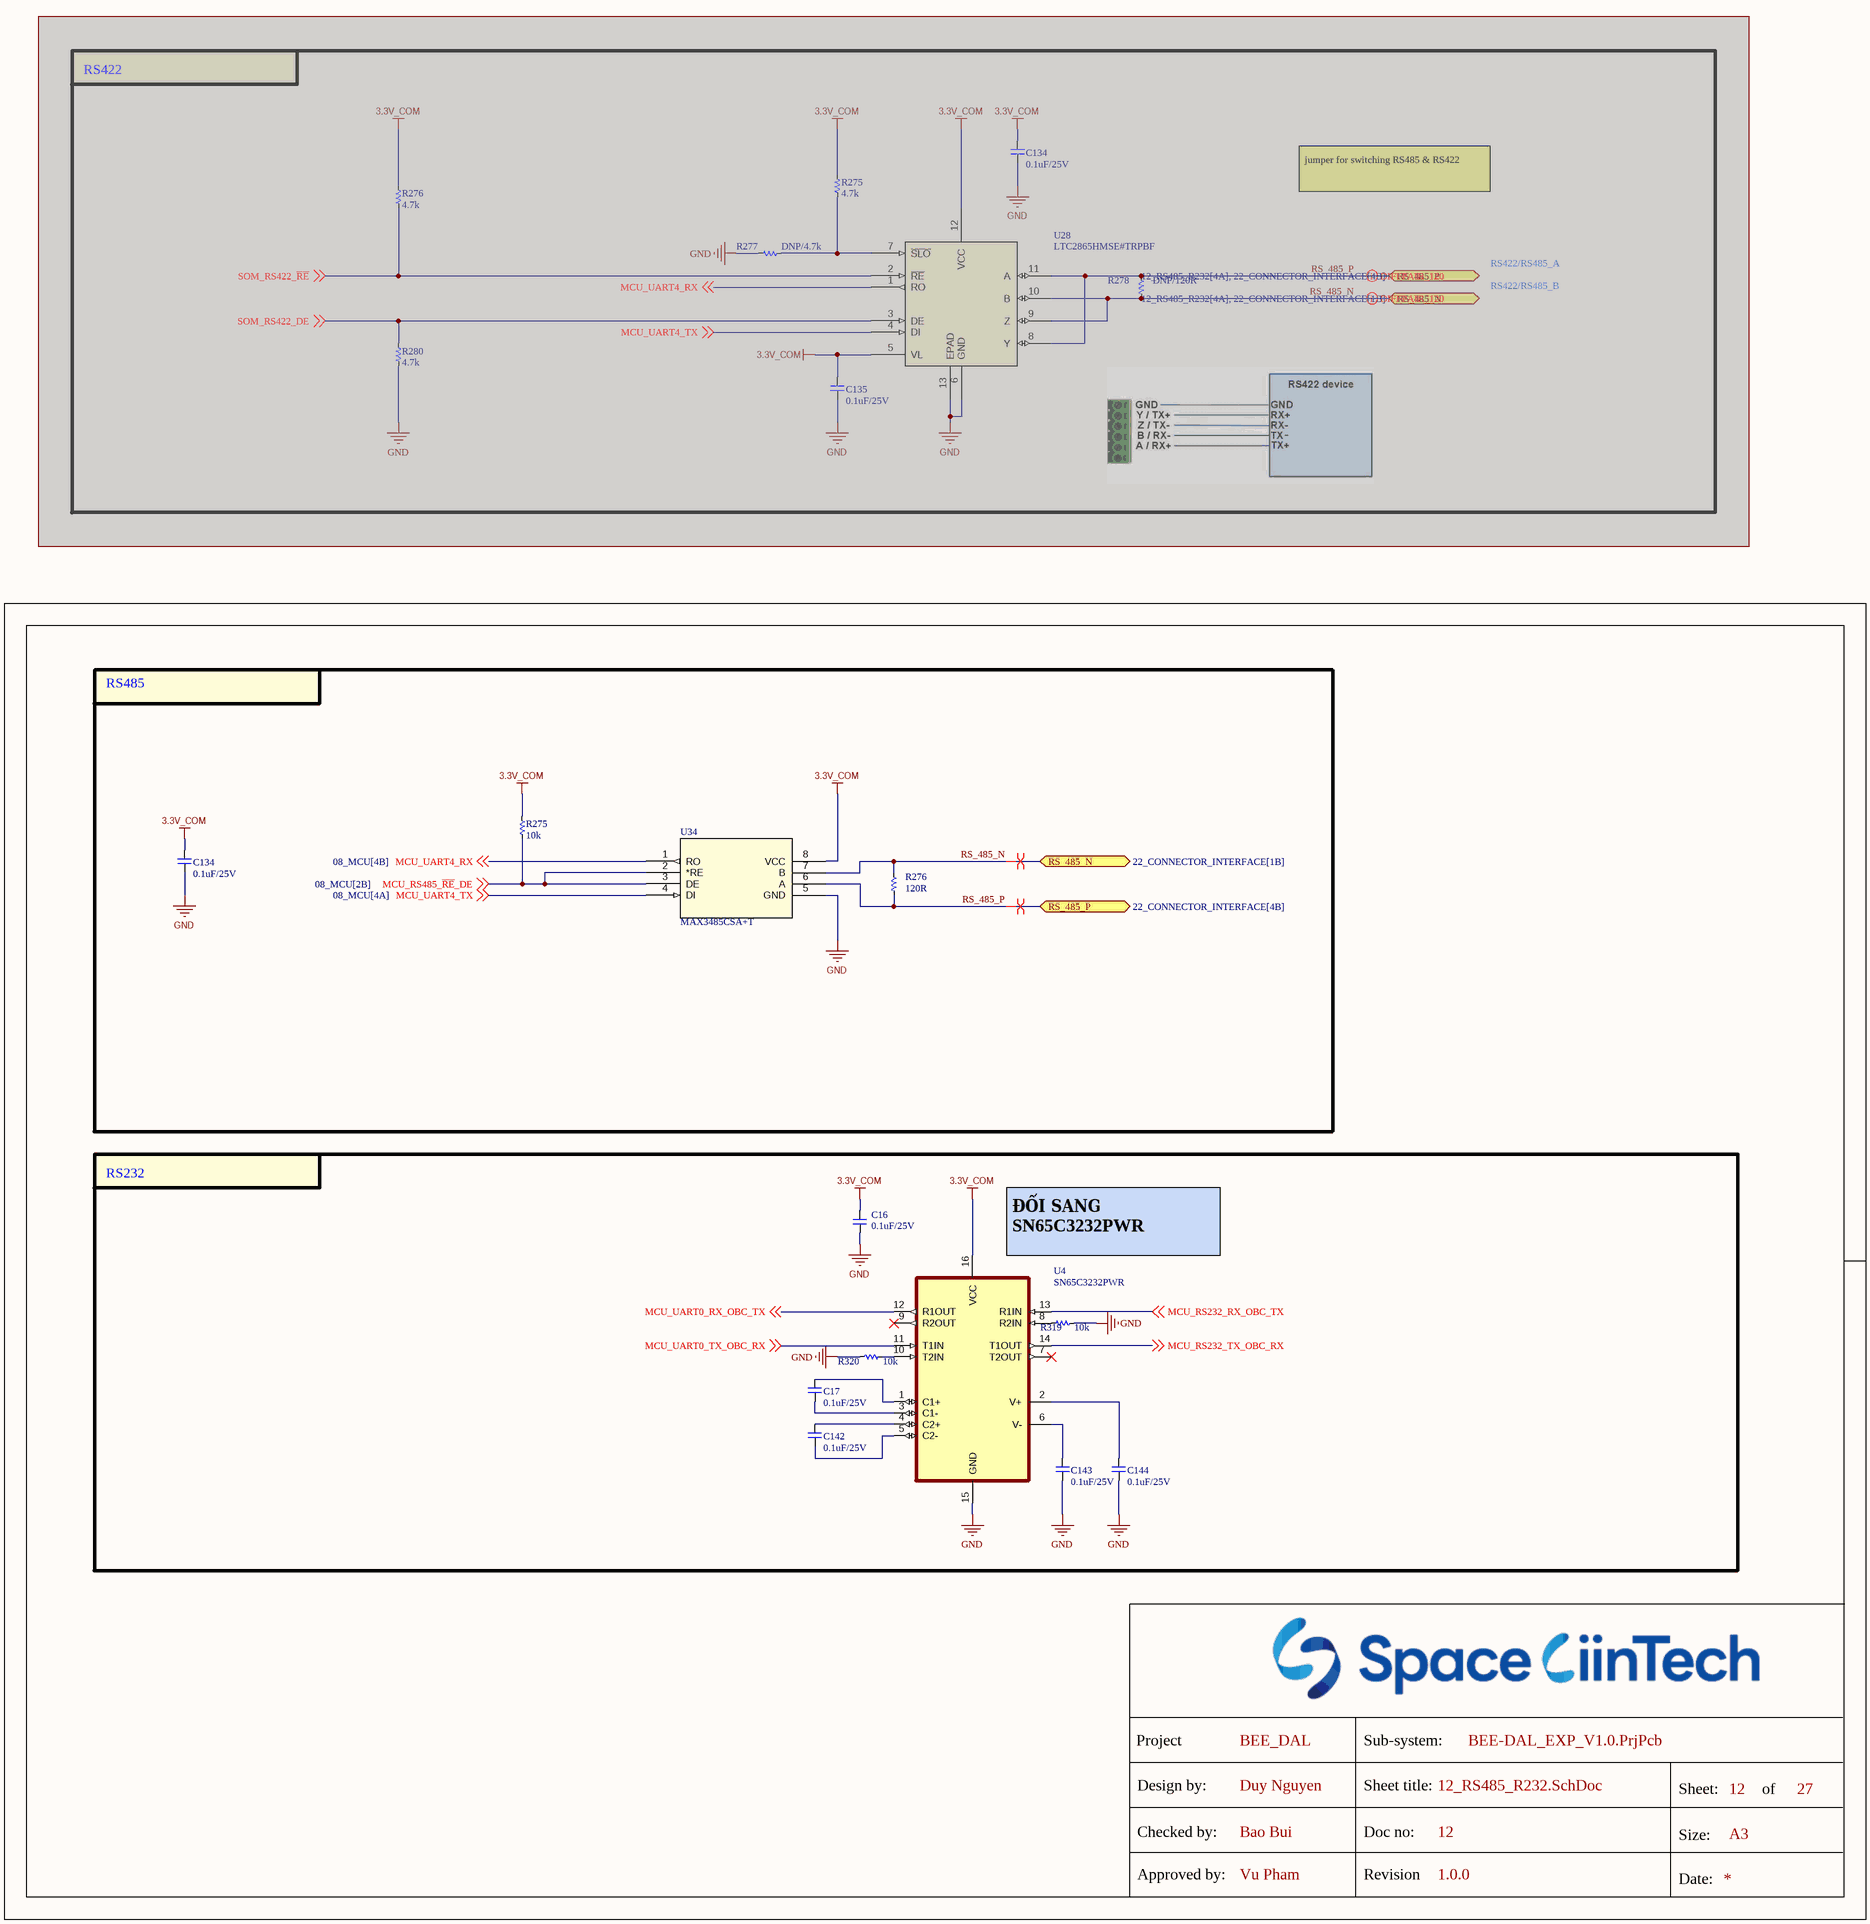
[diagram p14: 12_RS485_R232.SchDoc]

### Parts
(Parts that share a designator on the sheet are numbered #1, #2 ... from top to bottom, then left to right.)
C16  0.1uF/25V  [CAP_C_1608X80]
C17  0.1uF/25V  [CAP_C_1005X60]
C134#1  0.1uF/25V  [CAP_C_1005X60]  (masked out: inside a compile mask, not in the netlist)
C134#2  0.1uF/25V  [CAP_C_1005X60]
C135#1  0.1uF/25V  [CAP_C_1005X60]  (masked out: inside a compile mask, not in the netlist)
C142  0.1uF/25V  [CAP_C_1005X60]
C143  0.1uF/25V  [CAP_C_1005X60]
C144  0.1uF/25V  [CAP_C_1005X60]
R275#1  4.7k  [RES_C_1005X40]  (masked out: inside a compile mask, not in the netlist)
R275#2  10k  [RES_C_1005X40]
R276#1  4.7k  [RES_C_1005X40]  (masked out: inside a compile mask, not in the netlist)
R276#2  120R  [RES_C_1005X40]
R277#1  DNP/4.7k  [RES_C_1005X40]  (masked out: inside a compile mask, not in the netlist)
R278#1  DNP/120R  [RES_C_1005X40]  (masked out: inside a compile mask, not in the netlist)
R280#1  4.7k  [RES_C_1005X40]  (masked out: inside a compile mask, not in the netlist)
R319  10k  [RES_C_1005X40]
R320  10k  [RES_C_1005X40]
U4  SN65C3232PWR  [SOP65P640X120-16N]
U28#2  LTC2865HMSE#TRPBF  [MSOP-12_MSE_LIT]  (masked out: inside a compile mask, not in the netlist)
U34  MAX3485CSA+T  [21-0041-3-M_90-0096-8L_MXM]

### Blocks framed on the sheet
RS422: C134#1 C135#1 R275#1 R276#1 R277#1 R278#1 R280#1 U28#2
RS485: C134#2 R275#2 R276#2 U34
RS232: C16 C17 C142-C144 R319 R320 U4

### Ports
RS_485_N (bidir, see 12_RS485_R232[4A], 22_CONNECTOR_INTERFACE[1B]), RS_485_N (bidir, see 22_CONNECTOR_INTERFACE[1B]), RS_485_P (bidir, see 12_RS485_R232[4A], 22_CONNECTOR_INTERFACE[4B]), RS_485_P (bidir, see 22_CONNECTOR_INTERFACE[4B])

### Nets
3.3V_COM: C16.2 C134#2.2 R275#2.1 U4.16(VCC) U34.8(VCC)
GND: C16.1 C134#2.1 C143.1 C144.1 R319.1 R320.1 U4.15(GND) U34.5(GND)
MCU_RS232_RX_OBC_TX: U4.13(R1IN) ; off-sheet MCU_RS232_RX_OBC_TX
MCU_RS232_TX_OBC_RX: U4.14(T1OUT) ; off-sheet MCU_RS232_TX_OBC_RX
MCU_RS485_~{RE}_DE: R275#2.2 U34.2(*RE) U34.3(DE) ; off-sheet MCU_RS485_~{RE}_DE
MCU_UART0_RX_OBC_TX: U4.12(R1OUT) ; off-sheet MCU_UART0_RX_OBC_TX
MCU_UART0_TX_OBC_RX: U4.11(T1IN) ; off-sheet MCU_UART0_TX_OBC_RX
MCU_UART4_RX: U34.1(RO) ; off-sheet MCU_UART4_RX
MCU_UART4_TX: U34.4(DI) ; off-sheet MCU_UART4_TX
RS_485_N: R276#2.1 U34.7(B) ; port RS_485_N
RS_485_P: R276#2.2 U34.6(A) ; port RS_485_P
NetC17_1: C17.1 U4.3(C1-)
NetC17_2: C17.2 U4.1(C1+)
NetC142_1: C142.1 U4.5(C2-)
NetC142_2: C142.2 U4.4(C2+)
NetC143_2: C143.2 U4.6(V-)
NetC144_2: C144.2 U4.2(V+)
NetR319_2: R319.2 U4.8(R2IN)
NetR320_2: R320.2 U4.10(T2IN)

Not connected (* = marked no-connect by the designer): U4 7(T2OUT)* 9(R2OUT)*

### Layout directives
differential pair; differential pair class DIFFPAIR_120: (no net found under the mark)
differential pair; differential pair class DIFF90; net class DIFF90; rule Matched Net Lengths [Tolerance = 4mil]: RS_485_N, RS_485_P

### Notes on the sheet
- jumper for switching RS485 & RS422
- RS422/RS485_A
- RS422/RS485_B
- (near U4) ĐỔI SANG SN65C3232PWR
- Project
- Sub-system:
- Design by:
- Sheet title:
- Sheet:
- of
- Checked by:
- Approved by:
- Doc no:
- Revision
- Size:
- Date:

### Library data of the parts
C16 C17 C134#1 C134#2 C135#1 C142-C144 = _CAP_C_2: CAP
R275#1 R275#2 R276#1 R276#2 R277#1 R278#1 R280#1 R319 R320 = _RES_B_2: RES
U4 = IC_RS232_SN65C3232PWR: 2/2 Transceiver Full RS232 16-TSSOP 1GHz; MF: Analog Devices; MP: MAX3232CSE+T; SnapEDA_Link: https://www.snapeda.com/parts/MAX3232CSE+T/Analog+Devices/view-part/?ref=snap; Package: SOIC-16 Maxim Integrated; Value: *; Check_prices: https://www.snapeda.com/parts/MAX3232CSE+T/Analog+Devices/view-part/?ref=eda
U28#2 = LTC2865HMSETRPBF: Â±60V Fault Protected 3V to 5.5V RS485/RS422 Transceivers; Manufacturer_Name: Analog Devices Inc; Copyright: Copyright (C) 2025 Ultra Librarian. All rights reserved.; Manufacturer_Part_Number: LTC2865HMSE#TRPBF; RefDes: RefDes; Type: Type
U34 = MAX3485CSA+T: Low-Power, Slew-Rate-Limited RS-485/RS-422 Transceivers, IC TRANSCEIVER HALF 1/1 8SOIC; Manufacturer_Name: Analog Devices Inc; Manufacturer_Part_Number: MAX485CSA+T; Copyright: Copyright (C) 2025 Ultra Librarian. All rights reserved.; RefDes: RefDes; Type: Type

## Sheet 13_FLOW_Sensor.SchDoc
size 420 x 297 mm; SheetNumber: 13; SheetTotal: 27
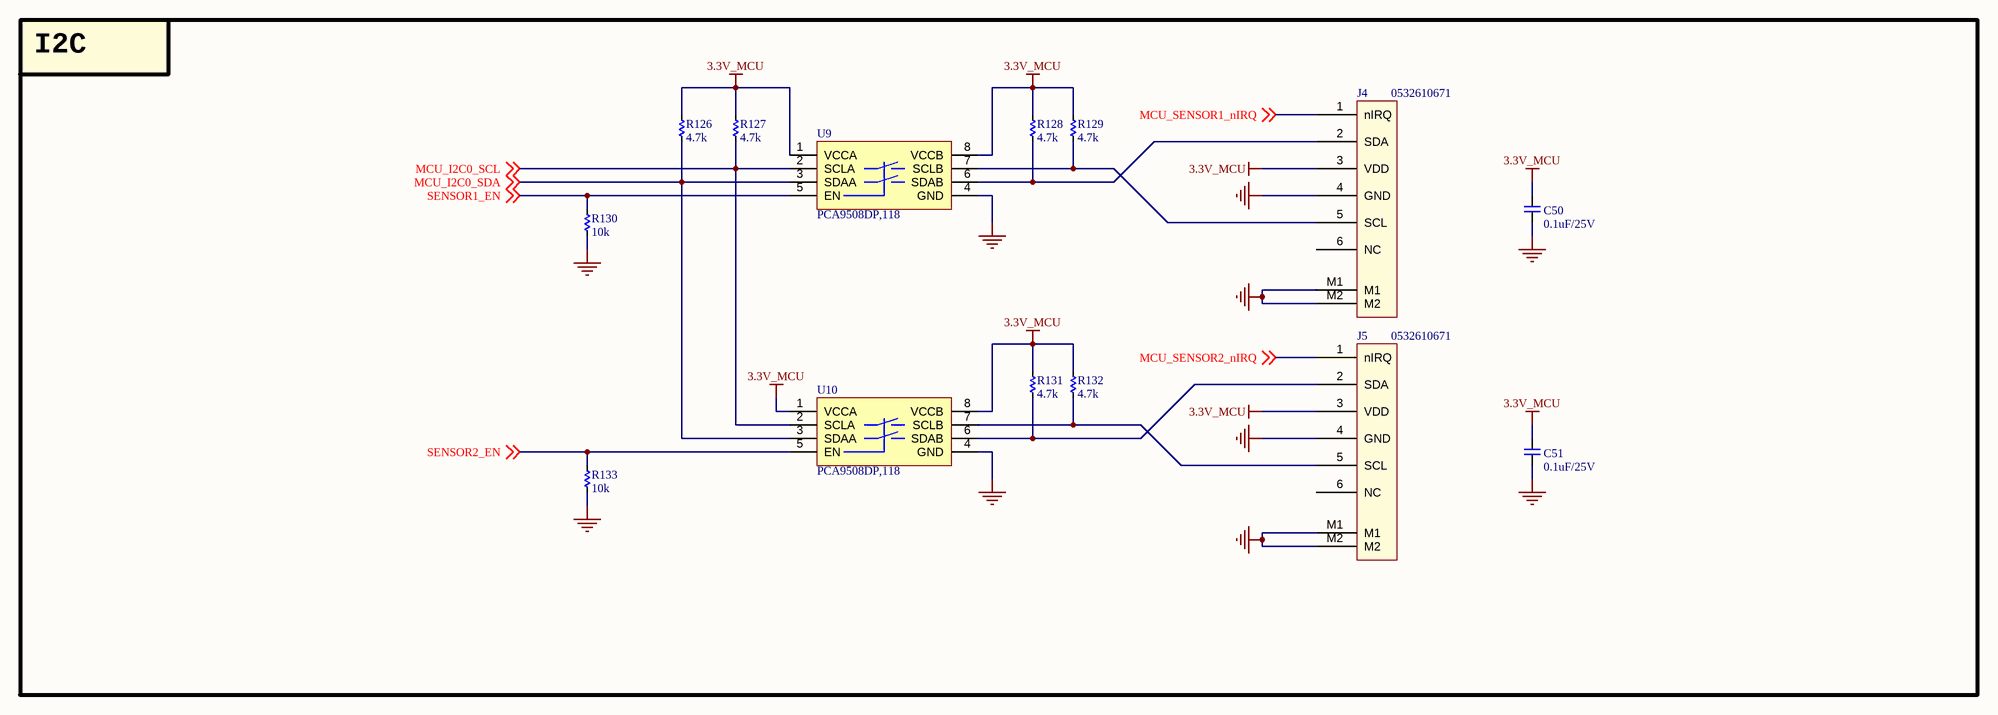
[diagram p15: 13_FLOW_Sensor.SchDoc]

### Parts
C50  0.1uF/25V  [CAP_C_1005X60]
C51  0.1uF/25V  [CAP_C_1005X60]
J4  0532610671  [MOLEX_0532610671]
J5  0532610671  [MOLEX_0532610671]
R126  4.7k  [RES_C_1005X40]
R127  4.7k  [RES_C_1005X40]
R128  4.7k  [RES_C_1005X40]
R129  4.7k  [RES_C_1005X40]
R130  10k  [RES_C_1005X40]
R131  4.7k  [RES_C_1005X40]
R132  4.7k  [RES_C_1005X40]
R133  10k  [RES_C_1005X40]
U9  PCA9508DP,118  [TSOP8]
U10  PCA9508DP,118  [TSOP8]

### Blocks framed on the sheet
I2C: C50 C51 J4 J5 R126-R133 U9 U10

### Nets
3.3V_MCU: C50.2 C51.2 J4.3(VDD) J5.3(VDD) R126.1 R127.1 R128.1 R129.1 R131.1 R132.1 U9.1(VCCA) U9.8(VCCB) U10.1(VCCA) U10.8(VCCB)
GND: C50.1 C51.1 J4.4(GND) J4.M1 J4.M2 J5.4(GND) J5.M1 J5.M2 R130.2 R133.2 U9.4(GND) U10.4(GND)
MCU_I2C0_SCL: R127.2 U9.2(SCLA) U10.2(SCLA) ; off-sheet MCU_I2C0_SCL
MCU_I2C0_SDA: R126.2 U9.3(SDAA) U10.3(SDAA) ; off-sheet MCU_I2C0_SDA
MCU_SENSOR1_nIRQ: J4.1(nIRQ) ; off-sheet MCU_SENSOR1_nIRQ
MCU_SENSOR2_nIRQ: J5.1(nIRQ) ; off-sheet MCU_SENSOR2_nIRQ
SENSOR1_EN: R130.1 U9.5(EN) ; off-sheet SENSOR1_EN
SENSOR2_EN: R133.1 U10.5(EN) ; off-sheet SENSOR2_EN
NetJ4_2: J4.2(SDA) R128.2 U9.6(SDAB)
NetJ4_5: J4.5(SCL) R129.2 U9.7(SCLB)
NetJ5_2: J5.2(SDA) R131.2 U10.6(SDAB)
NetJ5_5: J5.5(SCL) R132.2 U10.7(SCLB)

Not connected (* = marked no-connect by the designer): J4 6(NC); J5 6(NC)

### Notes on the sheet
- Project
- Sub-system:
- Design by:
- Sheet title:
- Sheet:
- of
- Checked by:
- Approved by:
- Doc no:
- Revision
- Size:
- Date:

### Library data of the parts
C50 C51 = _CAP_C_2: CAP
J4 J5 = FLOW_SENSOR
R126-R133 = _RES_B_2: RES

## Sheet 14_I2C_Sensor_OnBoard.SchDoc
size 420 x 297 mm; SheetNumber: 14; SheetTotal: 27
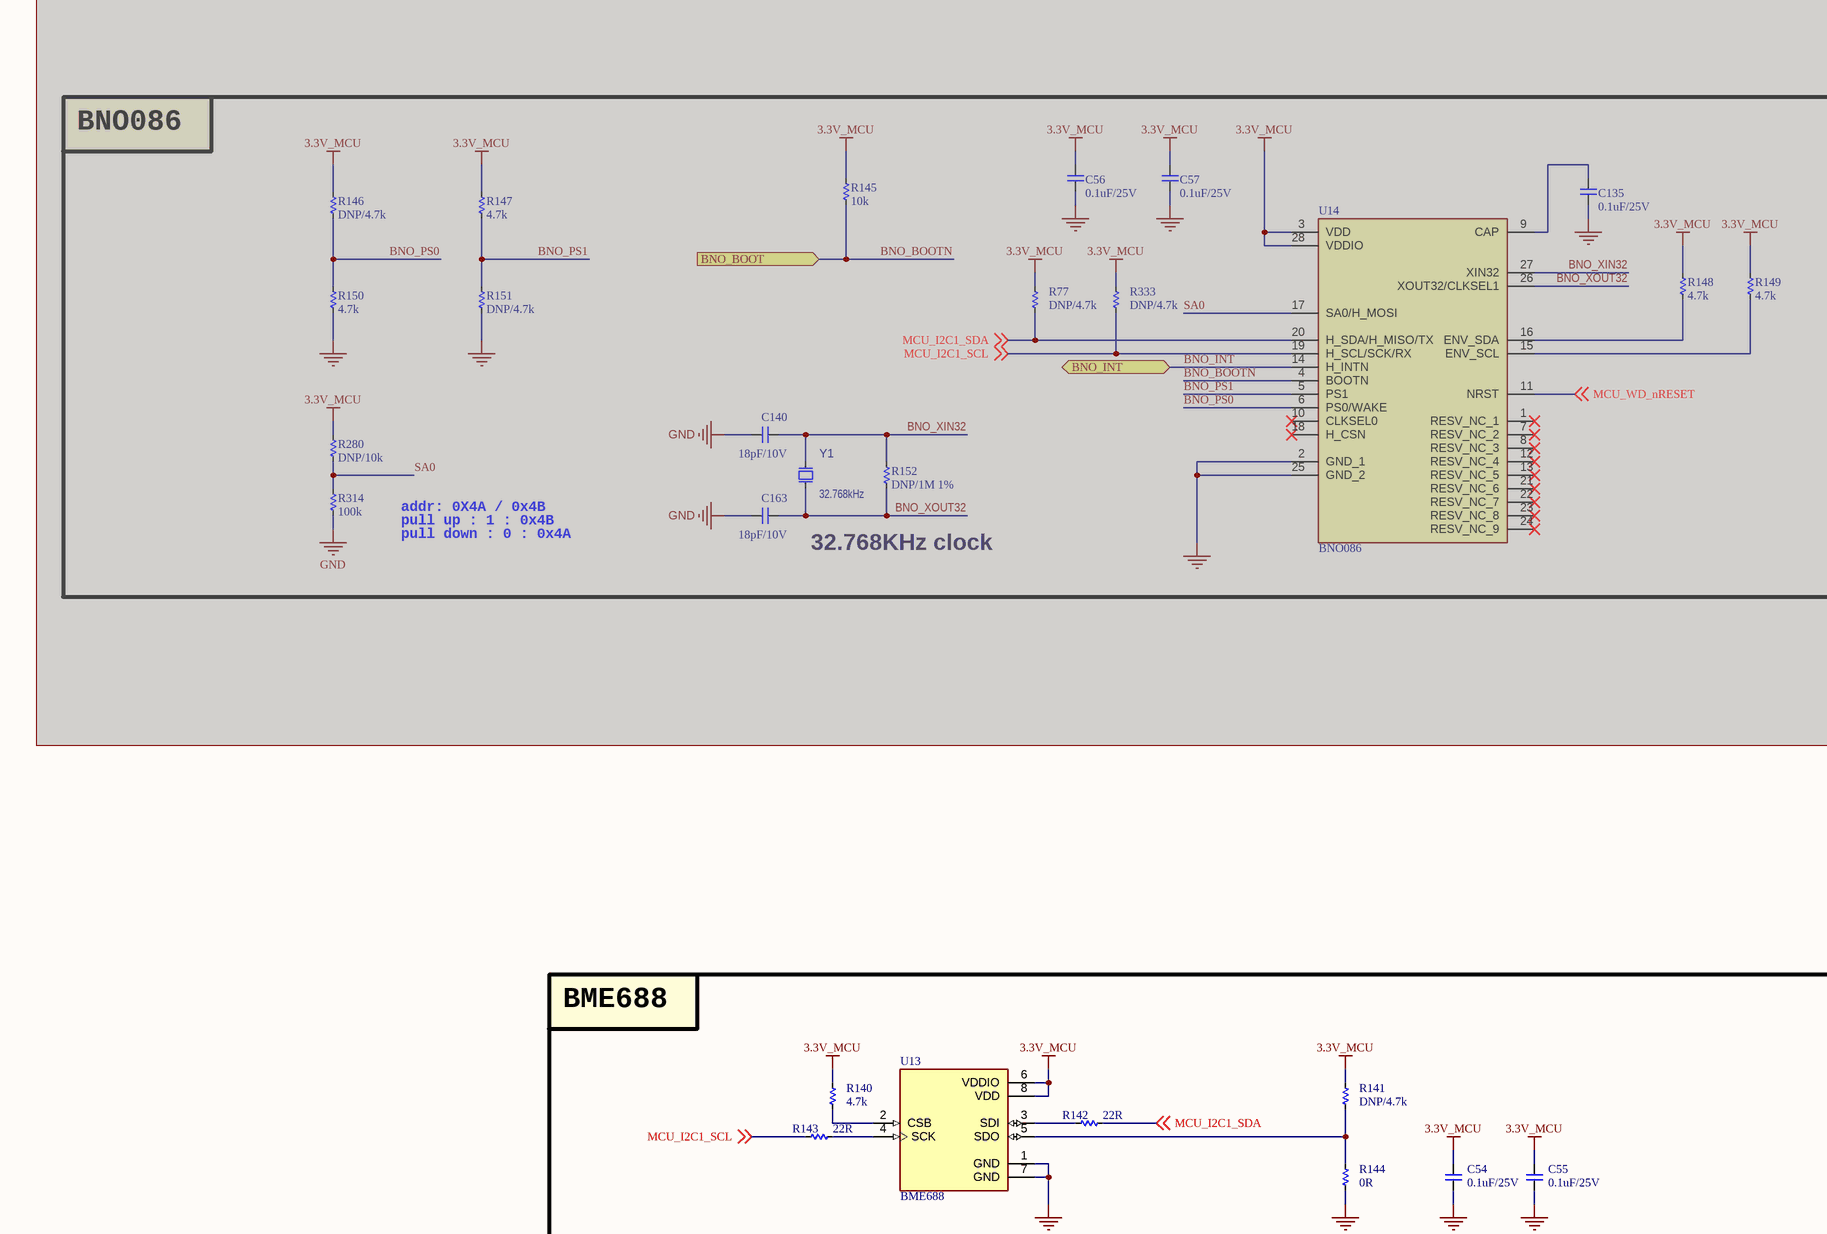
[diagram p16: 14_I2C_Sensor_OnBoard.SchDoc, top left]
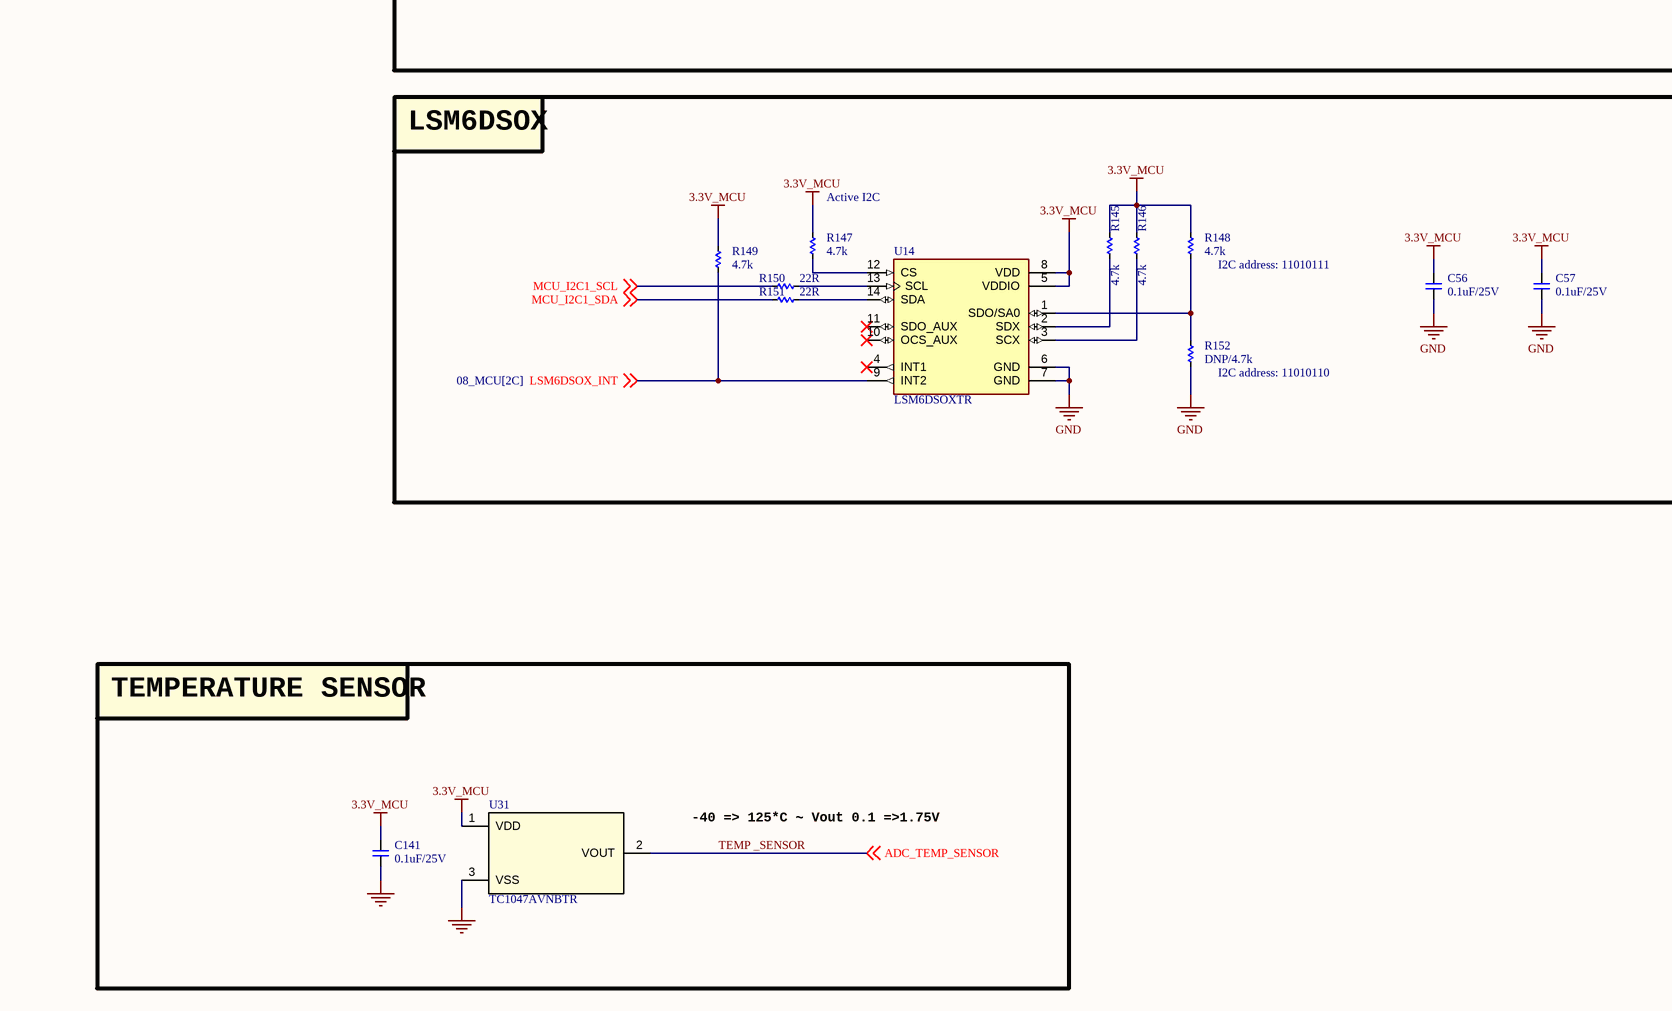
[diagram p17: 14_I2C_Sensor_OnBoard.SchDoc, bottom left]

### Parts
(Parts that share a designator on the sheet are numbered #1, #2 ... from top to bottom, then left to right.)
C54  0.1uF/25V  [CAP_C_1005X60]
C55  0.1uF/25V  [CAP_C_1005X60]
C56#1  0.1uF/25V  [CAP_C_1005X60]  (masked out: inside a compile mask, not in the netlist)
C56#2  0.1uF/25V  [CAP_C_1005X60]
C57#1  0.1uF/25V  [CAP_C_1005X60]  (masked out: inside a compile mask, not in the netlist)
C57#2  0.1uF/25V  [CAP_C_1005X60]
C135#2  0.1uF/25V  [CAP_C_1005X60]  (masked out: inside a compile mask, not in the netlist)
C140#2  18pF/10V  [CAP_C_1005X60]  (masked out: inside a compile mask, not in the netlist)
C141  0.1uF/25V  [CAP_C_1005X60]
C163  18pF/10V  [CAP_C_1005X60]  (masked out: inside a compile mask, not in the netlist)
R77#2  DNP/4.7k  [RES_C_1005X40]  (masked out: inside a compile mask, not in the netlist)
R140  4.7k  [RES_C_1005X40]
R141  DNP/4.7k  [RES_C_1005X40]
R142  22R  [RES_C_1005X40]
R143  22R  [RES_C_1005X40]
R144  0R  [RES_C_1005X40]
R145#1  10k  [RES_C_1005X40]  (masked out: inside a compile mask, not in the netlist)
R145#2  4.7k  [RES_C_1005X40]
R146#1  DNP/4.7k  [RES_C_1005X40]  (masked out: inside a compile mask, not in the netlist)
R146#2  4.7k  [RES_C_1005X40]
R147#1  4.7k  [RES_C_1005X40]  (masked out: inside a compile mask, not in the netlist)
R147#2  4.7k  [RES_C_1005X40]
R148#1  4.7k  [RES_C_1005X40]  (masked out: inside a compile mask, not in the netlist)
R148#2  4.7k  [RES_C_1005X40]
R149#1  4.7k  [RES_C_1005X40]  (masked out: inside a compile mask, not in the netlist)
R149#2  4.7k  [RES_C_1005X40]
R150#1  4.7k  [RES_C_1005X40]  (masked out: inside a compile mask, not in the netlist)
R150#2  22R  [RES_C_1005X40]
R151#1  DNP/4.7k  [RES_C_1005X40]  (masked out: inside a compile mask, not in the netlist)
R151#2  22R  [RES_C_1005X40]
R152#1  DNP/1M 1%  [RES_C_1005X40]  (masked out: inside a compile mask, not in the netlist)
R152#2  DNP/4.7k  [RES_C_1005X40]
R280#2  DNP/10k  [RES_C_1005X40]  (masked out: inside a compile mask, not in the netlist)
R314  100k  [RES_C_1005X40]  (masked out: inside a compile mask, not in the netlist)
R333  DNP/4.7k  [RES_C_1005X40]  (masked out: inside a compile mask, not in the netlist)
U13  BME688  [IC_BME688]
U14#1  BNO086  [BNO086]  (masked out: inside a compile mask, not in the netlist)
U14#2  LSM6DSOXTR  [PQFN50P250X300X86-14N]
U31  TC1047AVNBTR  [SOT95P240X120-3N]
Y1  value 32.768kHz  [CRYSTAL_NX2012SA]  (hidden comment: Crystal 2 Pins)  (masked out: inside a compile mask, not in the netlist)

### Blocks framed on the sheet
BNO086: C56#1 C57#1 C135#2 C140#2 C163 R77#2 R145#1 R146#1 R147#1 R148#1 R149#1 R150#1 R151#1 R152#1 R280#2 R314 R333 U14#1 Y1
BME688: C54 C55 R140-R144 U13
LSM6DSOX: C56#2 C57#2 R145#2 R146#2 R147#2 R148#2 R149#2 R150#2 R151#2 R152#2 U14#2
TEMPERATURE SENSOR: C141 U31

### Ports
BNO_BOOT (in), BNO_INT (bidir)

### Nets
3.3V_MCU: C54.2 C55.2 C56#2.2 C57#2.2 C141.2 R140.1 R141.1 R145#2.1 R146#2.1 R147#2.1 R148#2.1 R149#2.1 U13.6(VDDIO) U13.8(VDD) U14#2.5(VDDIO) U14#2.8(VDD) U31.1(VDD)
GND: C54.1 C55.1 C56#2.1 C57#2.1 C141.1 R144.2 R152#2.2 U13.1(GND) U13.7(GND) U14#2.6(GND) U14#2.7(GND) U31.3(VSS)
LSM6DSOX_INT: R149#2.2 U14#2.9(INT2) ; off-sheet LSM6DSOX_INT
MCU_I2C1_SCL: R143.1 R150#2.1 ; off-sheet MCU_I2C1_SCL
MCU_I2C1_SDA: R142.2 R151#2.1 ; off-sheet MCU_I2C1_SDA
TEMP _SENSOR: U31.2(VOUT) ; off-sheet ADC_TEMP_SENSOR  [also labelled ADC_TEMP_SENSOR]
NetR140_2: R140.2 U13.2(CSB)
NetR141_2: R141.2 R144.1 U13.5(SDO)
NetR142_1: R142.1 U13.3(SDI)
NetR143_2: R143.2 U13.4(SCK)
NetR145#2_2: R145#2.2 U14#2.2(SDX)
NetR146#2_2: R146#2.2 U14#2.3(SCX)
NetR147#2_2: R147#2.2 U14#2.12(CS)
NetR148#2_2: R148#2.2 R152#2.1 U14#2.1(SDO/SA0)
NetR150#2_2: R150#2.2 U14#2.13(SCL)
NetR151#2_2: R151#2.2 U14#2.14(SDA)

Not connected (* = marked no-connect by the designer): U14#2 4(INT1)* 10(OCS_AUX)* 11(SDO_AUX)*

### Notes on the sheet
- addr: 0X4A / 0x4B
- pull up : 1 : 0x4B
- pull down : 0 : 0x4A
- 32.768KHz clock
- (near R147#2) Active I2C
- (near R148#2) I2C address: 11010111
- (near R152#2) I2C address: 11010110
- -40 => 125*C ~ Vout 0.1 =>1.75V
- Project
- Sub-system:
- Design by:
- Sheet title:
- Sheet:
- of
- Checked by:
- Approved by:
- Doc no:
- Revision
- Size:
- Date:

### Library data of the parts
C54 C55 C56#1 C56#2 C57#1 C57#2 C135#2 C140#2 C141 C163 = _CAP_C_2: CAP
R77#2 R140-R144 R145#1 R145#2 R146#1 R146#2 R147#1 R147#2 R148#1 R148#2 R149#1 R149#2 R150#1 R150#2 R151#1 R151#2 R152#1 R152#2 R280#2 R314 R333 = _RES_B_2: RES
U13 = BME688: Gas sensor measuring relative humidity, barometric pressure, ambient temperature and gas (VOC); Package: None; MP: BME688; Price: None; Availability: Unavailable; Value: *
U14#1 = BNO086: Accelerometer, Gyroscope, Magnetometer, Temperature, 9 Axis Sensor IC, SPI Output; Manufacturer_Name: CEVA; Geometry.Height: 1.18mm; Mouser Part Number: 526-BNO086; Mouser Price/Stock: https://www.mouser.co.uk/ProductDetail/CEVA/BNO086?qs=ulEaXIWI0c%2FqTo1scjodAw%3D%3D; Manufacturer_Part_Number: BNO086; Datasheet Link: *
U14#2 = LSM6DSOXTR: Accelerometer, Gyroscope, 6 Axis Sensor I2C, SPI Output; MF: STMicroelectronics; SnapEDA_Link: https://www.snapeda.com/parts/LSM6DSOXTR/STMicroelectronics/view-part/?ref=snap; Package: VFLGA-14 STMicroelectronics; Value: *; MP: LSM6DSOXTR; Check_prices: https://www.snapeda.com/parts/LSM6DSOXTR/STMicroelectronics/view-part/?ref=eda
U31 = IC_SENSOR_TC1047AVNBTR: Temperature Sensor Analog, Local -40°C ~ 125°C 10mV/°C SOT-23-3
Y1 = OSC_32.768kHz: Crystal; Manufacturer 1: NDK; Manufacturer Part Number 1: NX2012SA-32.768K-STD-MUB-1; MCHP-ID: OSC1092; Description_: CRYSTAL 32.768kHz 12.5pF SMD NX2012SA; Dev Tools Status: Production; Owner: Jamus Griego; Tolerance: ±20ppm; Load Capacitance: 12.5pF; Populated: YES; Revision: 1; Symbol: Crystal 2 Pins; Status: MCL Design; ComponentLink1URL: https://chn-vm-apps.microchip.com/mchprepo/parts/Datasheets/c_NX2012SA-STD-MUB-1_e.pdf; ComponentLink1Description: SVN Datasheet; ComponentLink2URL: C:\ALTIUM_WORK\00001_MCHP-CDB\Datasheets\c_NX2012SA-STD-MUB-1_e.pdf; ComponentLink2Description: Local Datasheet; ComponentLink3URL: C:\ALTIUM_WORK\00001_MCHP-CDB\Library\LibraryRefs\Crystal 2 Pins.SchLib; ComponentLink3Description: Open Symbol; ComponentLink4URL: C:\ALTIUM_WORK\00001_MCHP-CDB\Library\Footprints\CRYSTAL_NX2012SA.PcbLib; ComponentLink4Description: Open Footprint; ComponentLink5Description: Open Footprint 2; ComponentLink6Description: Open Footprint 3; ComponentLink7Description: Open Footprint 4; Type: Crystal; Category: Crystal/Oscillator; Supplier 1: Digi-Key; Supplier Part Number 1: 644-1219-1-ND; Quantity Override: 1